# Altium project lagd_pcb.PrjPcb (part 3 of 4)

## Sheet analog_refs.SchDoc
size 699 x 359 mm; SheetNumber: 9; SheetTotal: 13
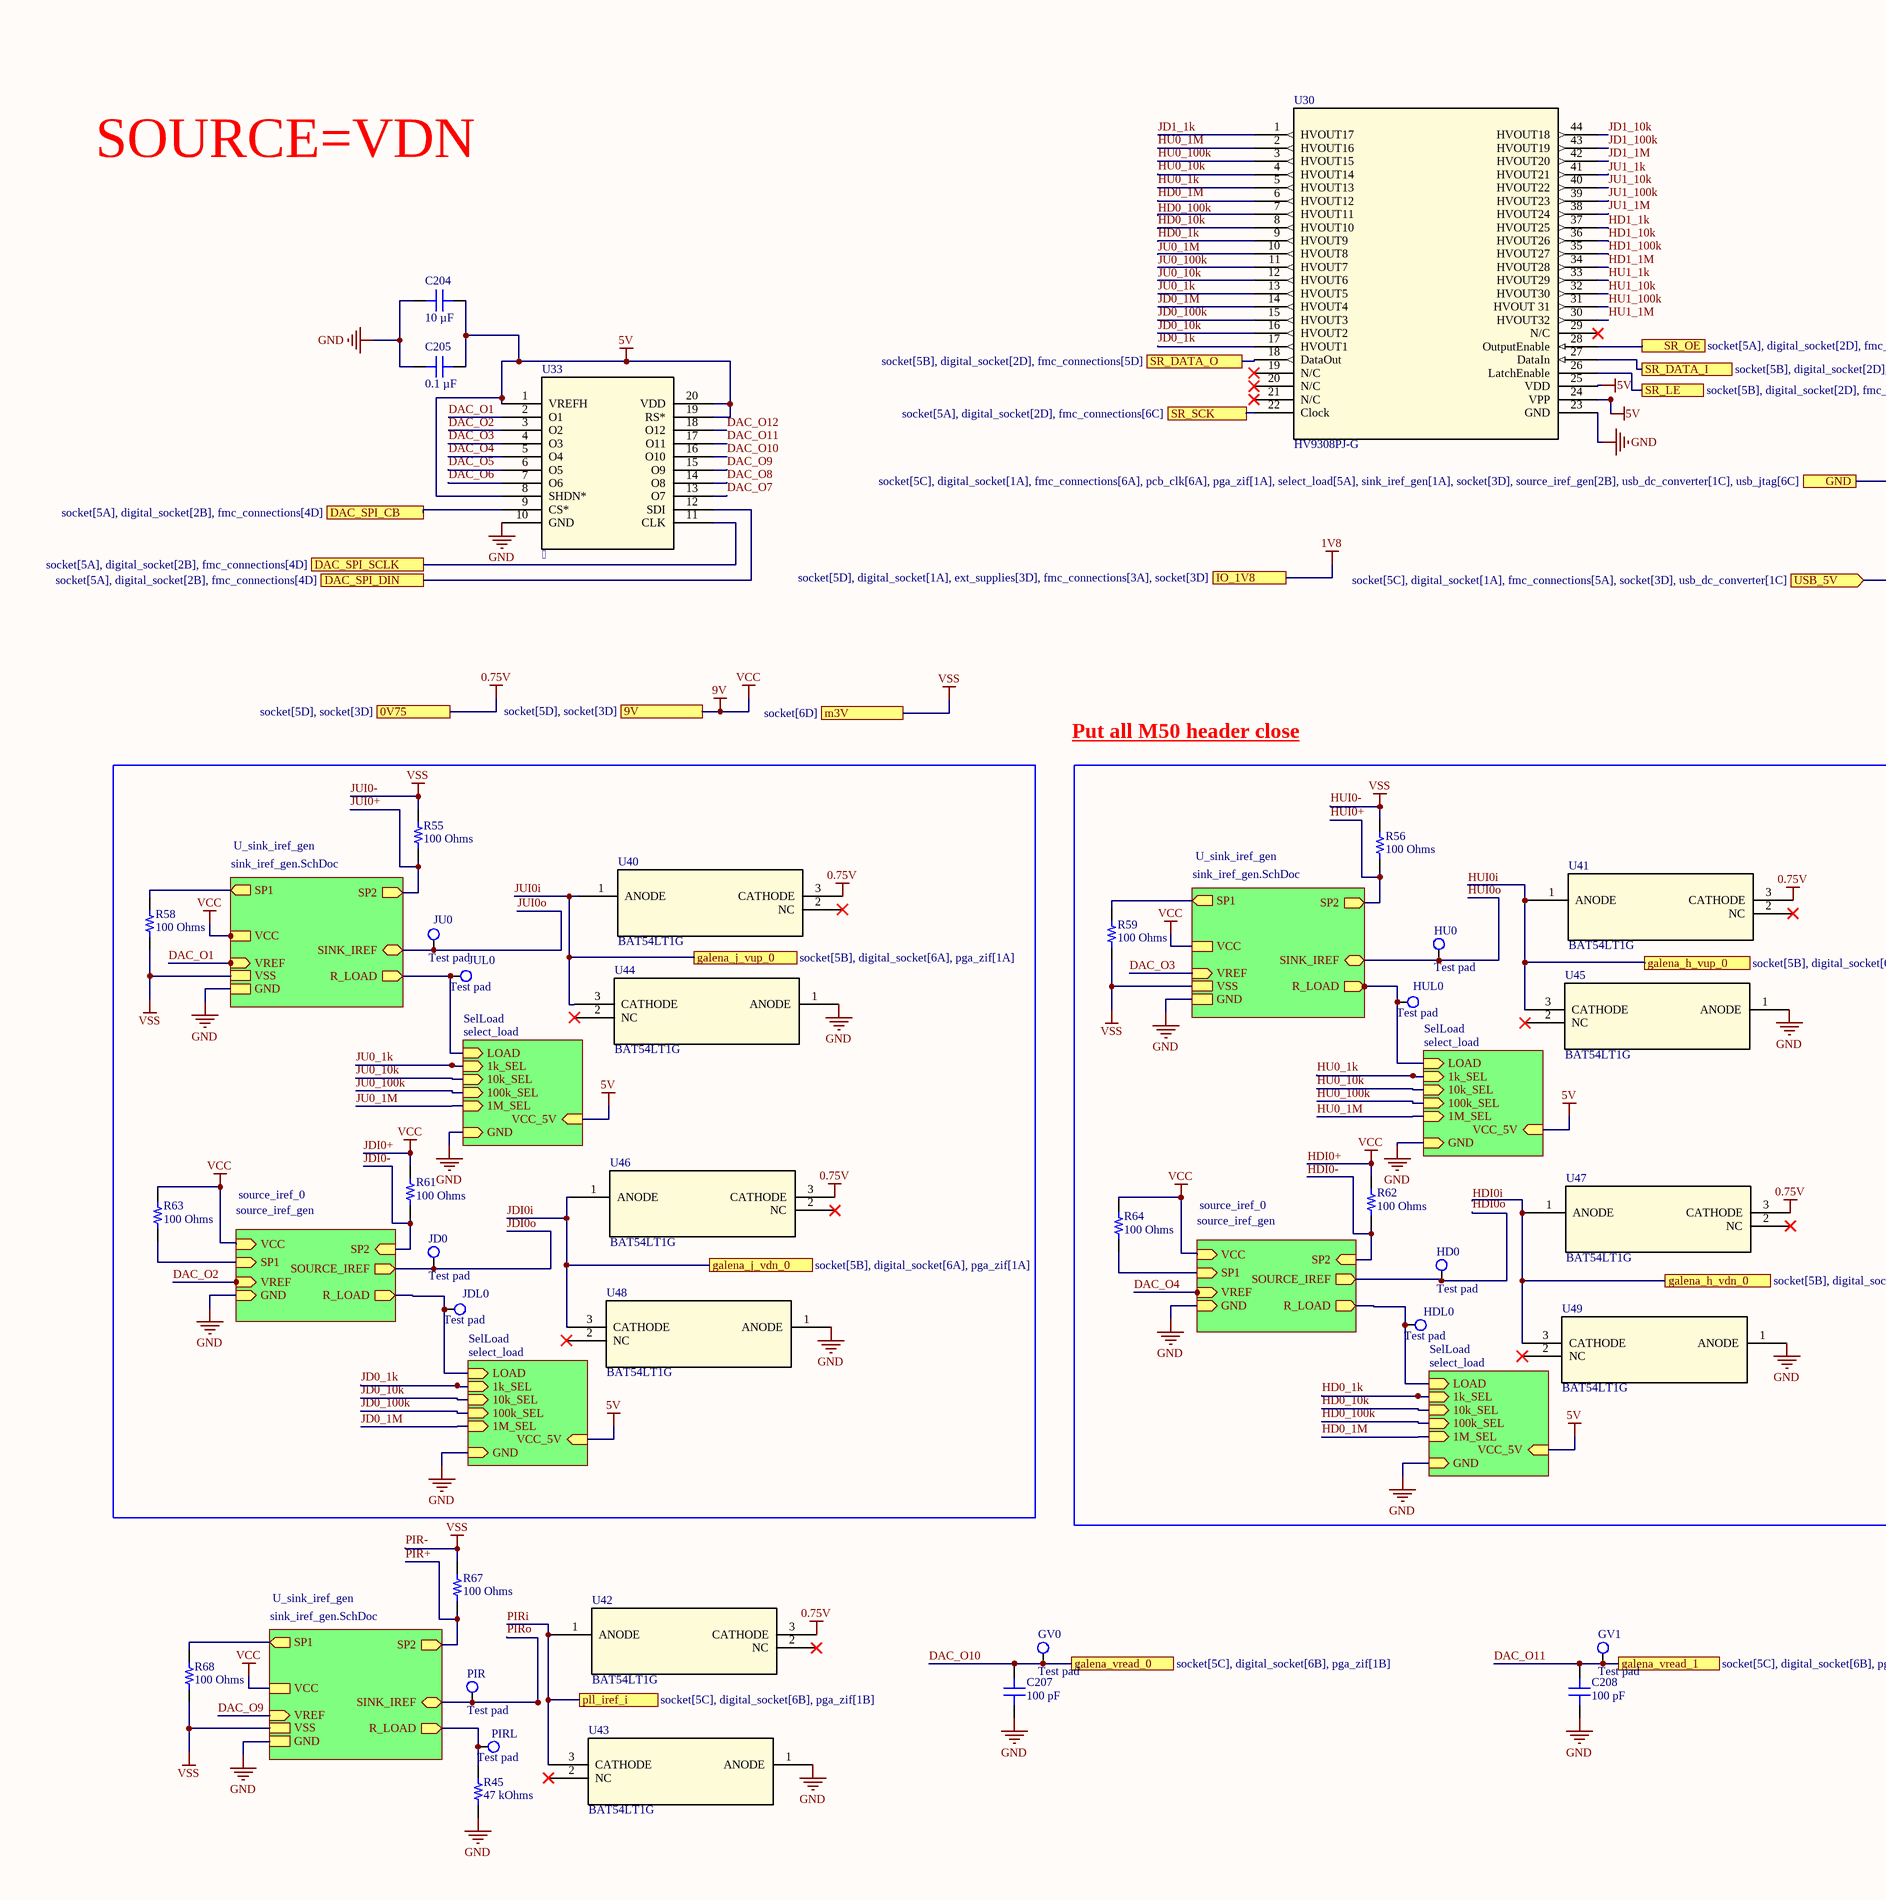
[diagram p5: analog_refs.SchDoc, left]
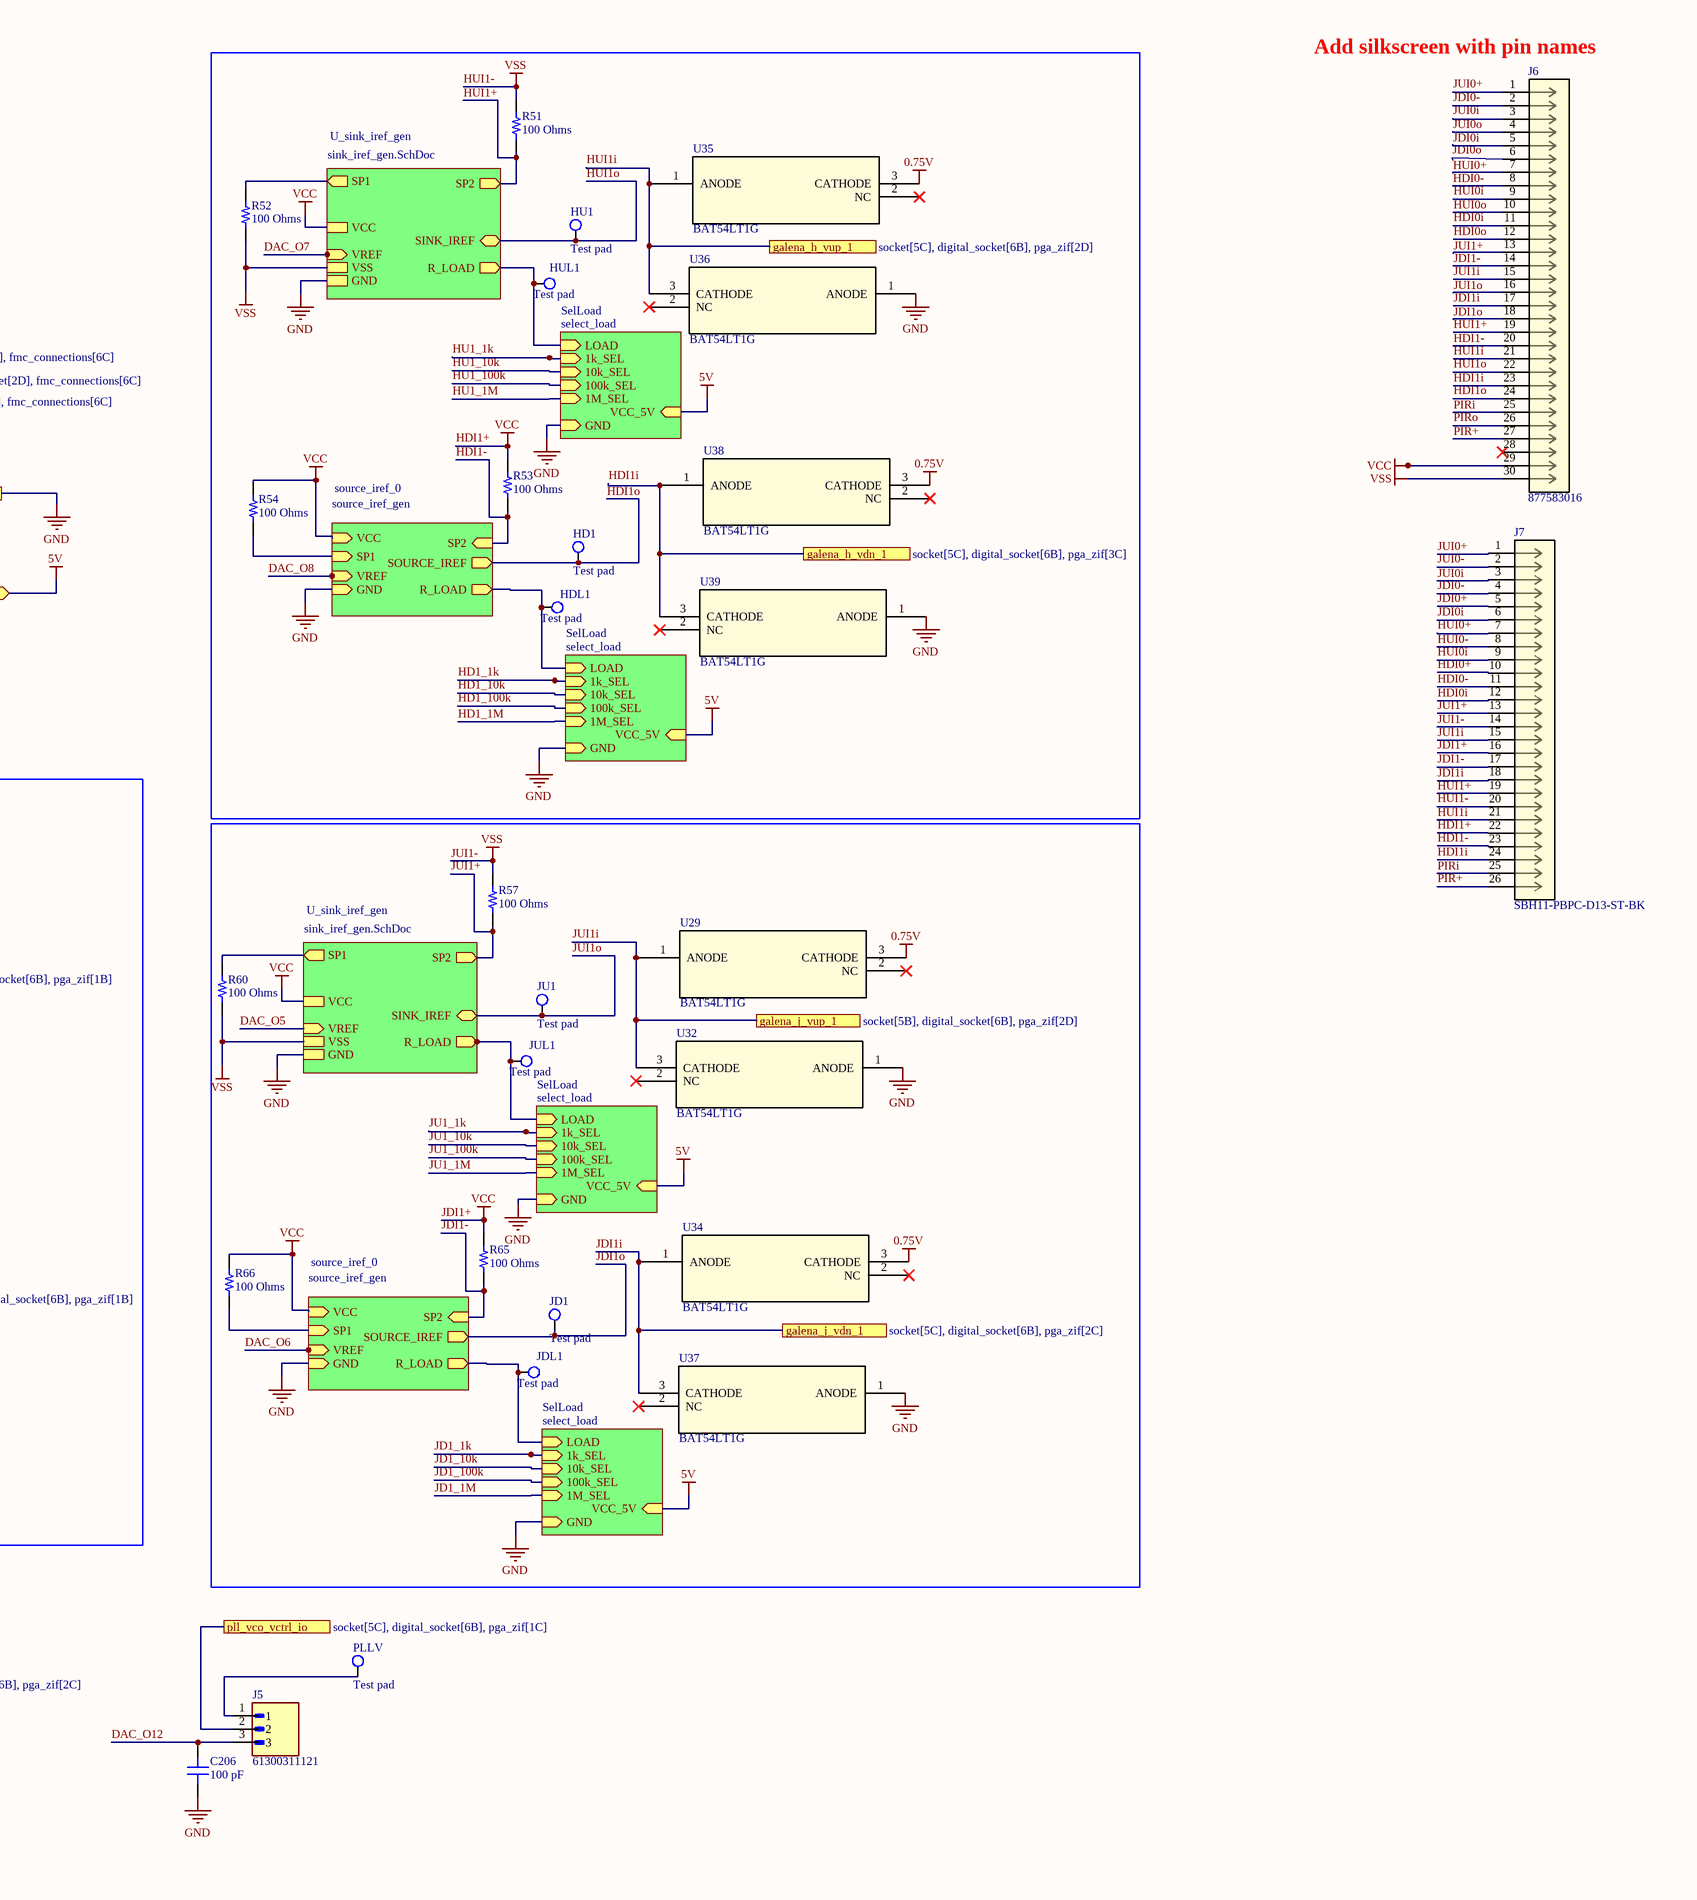
[diagram p6: analog_refs.SchDoc, right]

### Parts
C204  10 µF  [CAP 0805_2012]
C205  0.1 µF  [CAP 0805_2012]
C206  100 pF  [CAP 0805_2012]
C207  100 pF  [CAP 0805_2012]
C208  100 pF  [CAP 0805_2012]
GV0  Test pad  [Test Pad]
GV1  Test pad  [Test Pad]
HD0  Test pad  [Test Pad]
HD1  Test pad  [Test Pad]
HDL0  Test pad  [Test Pad]
HDL1  Test pad  [Test Pad]
HU0  Test pad  [Test Pad]
HU1  Test pad  [Test Pad]
HUL0  Test pad  [Test Pad]
HUL1  Test pad  [Test Pad]
J5  61300311121  [WURTH_61300311121]
J6  877583016  [CONN_SD-87758-107_30_MOL]
J7  SBH11-PBPC-D13-ST-BK  [CONN26_D13-ST-BK_SUL]
JD0  Test pad  [Test Pad]
JD1  Test pad  [Test Pad]
JDL0  Test pad  [Test Pad]
JDL1  Test pad  [Test Pad]
JU0  Test pad  [Test Pad]
JU1  Test pad  [Test Pad]
JUL0  Test pad  [Test Pad]
JUL1  Test pad  [Test Pad]
PIR  Test pad  [Test Pad]
PIRL  Test pad  [Test Pad]
PLLV  Test pad  [Test Pad]
R45  47 kOhms  [RES 0805_2012]
R51  100 Ohms  [RES 0805_2012]
R52  100 Ohms  [RES 0805_2012]
R53  100 Ohms  [RES 0805_2012]
R54  100 Ohms  [RES 0805_2012]
R55  100 Ohms  [RES 0805_2012]
R56  100 Ohms  [RES 0805_2012]
R57  100 Ohms  [RES 0805_2012]
R58  100 Ohms  [RES 0805_2012]
R59  100 Ohms  [RES 0805_2012]
R60  100 Ohms  [RES 0805_2012]
R61  100 Ohms  [RES 0805_2012]
R62  100 Ohms  [RES 0805_2012]
R63  100 Ohms  [RES 0805_2012]
R64  100 Ohms  [RES 0805_2012]
R65  100 Ohms  [RES 0805_2012]
R66  100 Ohms  [RES 0805_2012]
R67  100 Ohms  [RES 0805_2012]
R68  100 Ohms  [RES 0805_2012]
U29  BAT54LT1G  [SOT-23-3_1P4X3P040_ONS]
U30  HV9308PJ-G  [PLCC44_MC_MCH]
U32  BAT54LT1G  [SOT-23-3_1P4X3P040_ONS]
U33    [RU_20_ADI]
U34  BAT54LT1G  [SOT-23-3_1P4X3P040_ONS]
U35  BAT54LT1G  [SOT-23-3_1P4X3P040_ONS]
U36  BAT54LT1G  [SOT-23-3_1P4X3P040_ONS]
U37  BAT54LT1G  [SOT-23-3_1P4X3P040_ONS]
U38  BAT54LT1G  [SOT-23-3_1P4X3P040_ONS]
U39  BAT54LT1G  [SOT-23-3_1P4X3P040_ONS]
U40  BAT54LT1G  [SOT-23-3_1P4X3P040_ONS]
U41  BAT54LT1G  [SOT-23-3_1P4X3P040_ONS]
U42  BAT54LT1G  [SOT-23-3_1P4X3P040_ONS]
U43  BAT54LT1G  [SOT-23-3_1P4X3P040_ONS]
U44  BAT54LT1G  [SOT-23-3_1P4X3P040_ONS]
U45  BAT54LT1G  [SOT-23-3_1P4X3P040_ONS]
U46  BAT54LT1G  [SOT-23-3_1P4X3P040_ONS]
U47  BAT54LT1G  [SOT-23-3_1P4X3P040_ONS]
U48  BAT54LT1G  [SOT-23-3_1P4X3P040_ONS]
U49  BAT54LT1G  [SOT-23-3_1P4X3P040_ONS]

### Sub-sheets
SelLoad = select_load: LOAD (in), 1k_SEL (in), 10k_SEL (in), 100k_SEL (in), 1M_SEL (in), GND (in), VCC_5V (in)
SelLoad = select_load: LOAD (in), 1k_SEL (in), 10k_SEL (in), 100k_SEL (in), 1M_SEL (in), GND (in), VCC_5V (in)
SelLoad = select_load: LOAD (in), 1k_SEL (in), 10k_SEL (in), 100k_SEL (in), 1M_SEL (in), GND (in), VCC_5V (in)
SelLoad = select_load: LOAD (in), 1k_SEL (in), 10k_SEL (in), 100k_SEL (in), 1M_SEL (in), GND (in), VCC_5V (in)
SelLoad = select_load: LOAD (in), 1k_SEL (in), 10k_SEL (in), 100k_SEL (in), 1M_SEL (in), GND (in), VCC_5V (in)
SelLoad = select_load: LOAD (in), 1k_SEL (in), 10k_SEL (in), 100k_SEL (in), 1M_SEL (in), GND (in), VCC_5V (in)
SelLoad = select_load: LOAD (in), 1k_SEL (in), 10k_SEL (in), 100k_SEL (in), 1M_SEL (in), GND (in), VCC_5V (in)
SelLoad = select_load: LOAD (in), 1k_SEL (in), 10k_SEL (in), 100k_SEL (in), 1M_SEL (in), GND (in), VCC_5V (in)
source_iref_0 = source_iref_gen: R_LOAD (out), VREF (in), SOURCE_IREF (out), VCC (in), GND (in), SP1 (in), SP2 (in)
source_iref_0 = source_iref_gen: R_LOAD (out), VREF (in), SOURCE_IREF (out), VCC (in), GND (in), SP1 (in), SP2 (in)
source_iref_0 = source_iref_gen: R_LOAD (out), VREF (in), SOURCE_IREF (out), VCC (in), GND (in), SP1 (in), SP2 (in)
source_iref_0 = source_iref_gen: R_LOAD (out), VREF (in), SOURCE_IREF (out), VCC (in), GND (in), SP1 (in), SP2 (in)
U_sink_iref_gen = sink_iref_gen.SchDoc: SINK_IREF (bidir), R_LOAD (out), VREF (in), GND, VCC, VSS, SP2 (out), SP1 (out)
U_sink_iref_gen = sink_iref_gen.SchDoc: SINK_IREF (bidir), R_LOAD (out), VREF (in), GND, VCC, VSS, SP2 (out), SP1 (out)
U_sink_iref_gen = sink_iref_gen.SchDoc: SINK_IREF (bidir), R_LOAD (out), VREF (in), GND, VCC, VSS, SP2 (out), SP1 (out)
U_sink_iref_gen = sink_iref_gen.SchDoc: SINK_IREF (bidir), R_LOAD (out), VREF (in), GND, VCC, VSS, SP2 (out), SP1 (out)
U_sink_iref_gen = sink_iref_gen.SchDoc: SINK_IREF (bidir), R_LOAD (out), VREF (in), GND, VCC, VSS, SP2 (out), SP1 (out)

### Ports
0V75 (see socket[5D], socket[3D]), 9V (see socket[5D], socket[3D]), DAC_SPI_CB (see socket[5A], digital_socket[2B], fmc_connections[4D]), DAC_SPI_DIN (see socket[5A], digital_socket[2B], fmc_connections[4D]), DAC_SPI_SCLK (see socket[5A], digital_socket[2B], fmc_connections[4D]), galena_h_vdn_0 (see socket[5B], digital_socket[6B], pga_zif[1B]), galena_h_vdn_1 (see socket[5C], digital_socket[6B], pga_zif[3C]), galena_h_vup_0 (see socket[5B], digital_socket[6B], pga_zif[1B]), galena_h_vup_1 (see socket[5C], digital_socket[6B], pga_zif[2D]), galena_j_vdn_0 (see socket[5B], digital_socket[6A], pga_zif[1A]), galena_j_vdn_1 (see socket[5C], digital_socket[6B], pga_zif[2C]), galena_j_vup_0 (see socket[5B], digital_socket[6A], pga_zif[1A]), galena_j_vup_1 (see socket[5B], digital_socket[6B], pga_zif[2D]), galena_vread_0 (see socket[5C], digital_socket[6B], pga_zif[1B]), galena_vread_1 (see socket[5C], digital_socket[6B], pga_zif[2C]), GND (see socket[5C], digital_socket[1A], fmc_connections[6A], pcb_clk[6A], pga_zif[1A], select_load[5A], sink_iref_gen[1A], socket[3D], source_iref_gen[2B], usb_dc_converter[1C], usb_jtag[6C]), IO_1V8 (see socket[5D], digital_socket[1A], ext_supplies[3D], fmc_connections[3A], socket[3D]), m3V (see socket[6D]), pll_iref_i (see socket[5C], digital_socket[6B], pga_zif[1B]), pll_vco_vctrl_io (see socket[5C], digital_socket[6B], pga_zif[1C]), SR_DATA_I (see socket[5B], digital_socket[2D], fmc_connections[6C]), SR_DATA_O (see socket[5B], digital_socket[2D], fmc_connections[5D]), SR_LE (see socket[5B], digital_socket[2D], fmc_connections[6C]), SR_OE (see socket[5A], digital_socket[2D], fmc_connections[6C]), SR_SCK (see socket[5A], digital_socket[2D], fmc_connections[6C]), USB_5V (in, see socket[5C], digital_socket[1A], fmc_connections[5A], socket[3D], usb_dc_converter[1C])

### Nets
0.75V: U29.3(CATHODE) U34.3(CATHODE) U35.3(CATHODE) U38.3(CATHODE) U40.3(CATHODE) U41.3(CATHODE) U42.3(CATHODE) U46.3(CATHODE) U47.3(CATHODE) ; port 0V75  [project net PCB_CORE_0V75]
5V: C204.2 C205.2 U30.24(VPP) U30.25(VDD) U33.1(VREFH) U33.8(SHDN*) U33.19(RS*) U33.20(VDD) ; port USB_5V, sheet SelLoad/VCC_5V, sheet SelLoad/VCC_5V, sheet SelLoad/VCC_5V, sheet SelLoad/VCC_5V, sheet SelLoad/VCC_5V, sheet SelLoad/VCC_5V, sheet SelLoad/VCC_5V, sheet SelLoad/VCC_5V  [project net VBIAS]
GND: C204.1 C205.1 C206.1 C207.1 C208.1 R45.1 U30.23(GND) U32.1(ANODE) U33.10(GND) U36.1(ANODE) U37.1(ANODE) U39.1(ANODE) U43.1(ANODE) U44.1(ANODE) U45.1(ANODE) U48.1(ANODE) U49.1(ANODE) ; port GND, sheet SelLoad/GND, sheet source_iref_0/GND, sheet SelLoad/GND, sheet SelLoad/GND, sheet SelLoad/GND, sheet SelLoad/GND, sheet SelLoad/GND, sheet SelLoad/GND, sheet SelLoad/GND, sheet source_iref_0/GND, sheet source_iref_0/GND, sheet source_iref_0/GND, sheet U_sink_iref_gen/GND, sheet U_sink_iref_gen/GND, sheet U_sink_iref_gen/GND, sheet U_sink_iref_gen/GND, sheet U_sink_iref_gen/GND  [project net A0]
HDI0+: J6.29 J7.5 J7.10 J7.16 J7.22 R53.2 R54.2 R61.2 R62.2 R63.2 R64.2 R65.2 R66.2 ; port 9V, sheet source_iref_0/VCC, sheet source_iref_0/VCC, sheet source_iref_0/VCC, sheet source_iref_0/VCC, sheet U_sink_iref_gen/VCC, sheet U_sink_iref_gen/VCC, sheet U_sink_iref_gen/VCC, sheet U_sink_iref_gen/VCC, sheet U_sink_iref_gen/VCC  [also labelled 9V, HDI1+, JDI0+, JDI1+, VCC]
HUI0-: J6.30 J7.2 J7.8 J7.14 J7.20 R51.2 R52.1 R55.2 R56.2 R57.2 R58.1 R59.1 R60.1 R67.2 R68.1 ; port m3V, sheet U_sink_iref_gen/VSS, sheet U_sink_iref_gen/VSS, sheet U_sink_iref_gen/VSS, sheet U_sink_iref_gen/VSS, sheet U_sink_iref_gen/VSS  [also labelled HUI1-, JUI0-, JUI1-, PIR-, VSS]
DAC_O1: U33.2(O1) ; sheet U_sink_iref_gen/VREF
DAC_O2: U33.3(O2) ; sheet source_iref_0/VREF
DAC_O3: U33.4(O3) ; sheet U_sink_iref_gen/VREF
DAC_O4: U33.5(O4) ; sheet source_iref_0/VREF
DAC_O5: U33.6(O5) ; sheet U_sink_iref_gen/VREF
DAC_O6: U33.7(O6) ; sheet source_iref_0/VREF
DAC_O7: U33.13(O7) ; sheet U_sink_iref_gen/VREF
DAC_O8: U33.14(O8) ; sheet source_iref_0/VREF
DAC_O9: U33.15(O9) ; sheet U_sink_iref_gen/VREF
DAC_O10: C207.2 GV0.1 U33.16(O10) ; port galena_vread_0
DAC_O11: C208.2 GV1.1 U33.17(O11) ; port galena_vread_1
DAC_O12: C206.2 J5.3 U33.18(O12)
HD0_1k: U30.9(HVOUT9) ; sheet SelLoad/1k_SEL
HD0_1M: U30.6(HVOUT12) ; sheet SelLoad/1M_SEL
HD0_10k: U30.8(HVOUT10) ; sheet SelLoad/10k_SEL
HD0_100k: U30.7(HVOUT11) ; sheet SelLoad/100k_SEL
HD1_1k: U30.37(HVOUT25) ; sheet SelLoad/1k_SEL
HD1_1M: U30.34(HVOUT28) ; sheet SelLoad/1M_SEL
HD1_10k: U30.36(HVOUT26) ; sheet SelLoad/10k_SEL
HD1_100k: U30.35(HVOUT27) ; sheet SelLoad/100k_SEL
HDI0-: J6.8 J7.11 R62.1 ; sheet source_iref_0/SP2
HDI0i: J6.11 J7.12 U47.1(ANODE) U49.3(CATHODE) ; port galena_h_vdn_0
HDI0o: HD0.1 J6.12 ; sheet source_iref_0/SOURCE_IREF
HDI1-: J6.20 J7.23 R53.1 ; sheet source_iref_0/SP2
HDI1i: J6.23 J7.24 U38.1(ANODE) U39.3(CATHODE) ; port galena_h_vdn_1
HDI1o: HD1.1 J6.24 ; sheet source_iref_0/SOURCE_IREF
HU0_1k: U30.5(HVOUT13) ; sheet SelLoad/1k_SEL
HU0_1M: U30.2(HVOUT16) ; sheet SelLoad/1M_SEL
HU0_10k: U30.4(HVOUT14) ; sheet SelLoad/10k_SEL
HU0_100k: U30.3(HVOUT15) ; sheet SelLoad/100k_SEL
HU1_1k: U30.33(HVOUT29) ; sheet SelLoad/1k_SEL
HU1_1M: U30.30(HVOUT32) ; sheet SelLoad/1M_SEL
HU1_10k: U30.32(HVOUT30) ; sheet SelLoad/10k_SEL
HU1_100k: U30.31(HVOUT_31) ; sheet SelLoad/100k_SEL
HUI0+: J6.7 J7.7 R56.1 ; sheet U_sink_iref_gen/SP2
HUI0i: J6.9 J7.9 U41.1(ANODE) U45.3(CATHODE) ; port galena_h_vup_0
HUI0o: HU0.1 J6.10 ; sheet U_sink_iref_gen/SINK_IREF
HUI1+: J6.19 J7.19 R51.1 ; sheet U_sink_iref_gen/SP2
HUI1i: J6.21 J7.21 U35.1(ANODE) U36.3(CATHODE) ; port galena_h_vup_1
HUI1o: HU1.1 J6.22 ; sheet U_sink_iref_gen/SINK_IREF
JD0_1k: U30.17(HVOUT1) ; sheet SelLoad/1k_SEL
JD0_1M: U30.14(HVOUT4) ; sheet SelLoad/1M_SEL
JD0_10k: U30.16(HVOUT2) ; sheet SelLoad/10k_SEL
JD0_100k: U30.15(HVOUT3) ; sheet SelLoad/100k_SEL
JD1_1k: U30.1(HVOUT17) ; sheet SelLoad/1k_SEL
JD1_1M: U30.42(HVOUT20) ; sheet SelLoad/1M_SEL
JD1_10k: U30.44(HVOUT18) ; sheet SelLoad/10k_SEL
JD1_100k: U30.43(HVOUT19) ; sheet SelLoad/100k_SEL
JDI0-: J6.2 J7.4 R61.1 ; sheet source_iref_0/SP2
JDI0i: J6.5 J7.6 U46.1(ANODE) U48.3(CATHODE) ; port galena_j_vdn_0
JDI0o: J6.6 JD0.1 ; sheet source_iref_0/SOURCE_IREF
JDI1-: J6.14 J7.17 R65.1 ; sheet source_iref_0/SP2
JDI1i: J6.17 J7.18 U34.1(ANODE) U37.3(CATHODE) ; port galena_j_vdn_1
JDI1o: J6.18 JD1.1 ; sheet source_iref_0/SOURCE_IREF
JU0_1k: U30.13(HVOUT5) ; sheet SelLoad/1k_SEL
JU0_1M: U30.10(HVOUT8) ; sheet SelLoad/1M_SEL
JU0_10k: U30.12(HVOUT6) ; sheet SelLoad/10k_SEL
JU0_100k: U30.11(HVOUT7) ; sheet SelLoad/100k_SEL
JU1_1k: U30.41(HVOUT21) ; sheet SelLoad/1k_SEL
JU1_1M: U30.38(HVOUT24) ; sheet SelLoad/1M_SEL
JU1_10k: U30.40(HVOUT22) ; sheet SelLoad/10k_SEL
JU1_100k: U30.39(HVOUT23) ; sheet SelLoad/100k_SEL
JUI0+: J6.1 J7.1 R55.1 ; sheet U_sink_iref_gen/SP2
JUI0i: J6.3 J7.3 U40.1(ANODE) U44.3(CATHODE) ; port galena_j_vup_0
JUI0o: J6.4 JU0.1 ; sheet U_sink_iref_gen/SINK_IREF
JUI1+: J6.13 J7.13 R57.1 ; sheet U_sink_iref_gen/SP2
JUI1i: J6.15 J7.15 U29.1(ANODE) U32.3(CATHODE) ; port galena_j_vup_1
JUI1o: J6.16 JU1.1 ; sheet U_sink_iref_gen/SINK_IREF
PIR+: J6.27 J7.26 R67.1 ; sheet U_sink_iref_gen/SP2
PIRi: J6.25 J7.25 U42.1(ANODE) U43.3(CATHODE) ; port pll_iref_i
PIRo: J6.26 PIR.1 ; sheet U_sink_iref_gen/SINK_IREF
NetHDL0_1: HDL0.1 ; sheet SelLoad/LOAD, sheet source_iref_0/R_LOAD
NetHDL1_1: HDL1.1 ; sheet SelLoad/LOAD, sheet source_iref_0/R_LOAD
NetHUL0_1: HUL0.1 ; sheet SelLoad/LOAD, sheet U_sink_iref_gen/R_LOAD
NetHUL1_1: HUL1.1 ; sheet SelLoad/LOAD, sheet U_sink_iref_gen/R_LOAD
NetJ2_H3: J5.2 ; port pll_vco_vctrl_io
NetJ5_1: J5.1 PLLV.1
NetJDL0_1: JDL0.1 ; sheet source_iref_0/R_LOAD, sheet SelLoad/LOAD
NetJDL1_1: JDL1.1 ; sheet SelLoad/LOAD, sheet source_iref_0/R_LOAD
NetJUL0_1: JUL0.1 ; sheet SelLoad/LOAD
NetJUL1_1: JUL1.1 ; sheet SelLoad/LOAD, sheet U_sink_iref_gen/R_LOAD
NetPIRL_1: PIRL.1 R45.2 ; sheet U_sink_iref_gen/R_LOAD
NetR52_2: R52.2 ; sheet U_sink_iref_gen/SP1
NetR54_1: R54.1 ; sheet source_iref_0/SP1
NetR58_2: R58.2 ; sheet U_sink_iref_gen/SP1
NetR59_2: R59.2 ; sheet U_sink_iref_gen/SP1
NetR60_2: R60.2 ; sheet U_sink_iref_gen/SP1
NetR63_1: R63.1 ; sheet source_iref_0/SP1
NetR64_1: R64.1 ; sheet source_iref_0/SP1
NetR66_1: R66.1 ; sheet source_iref_0/SP1
NetR68_2: R68.2 ; sheet U_sink_iref_gen/SP1
NetU24_2: U30.18(DataOut) ; port SR_DATA_O
NetU25_10: U30.27(DataIn) ; port SR_DATA_I
NetU25_11: U30.26(LatchEnable) ; port SR_LE
NetU25_12: U30.28(OutputEnable) ; port SR_OE
NetU25_13: U30.22(Clock) ; port SR_SCK
NetU28_11: U33.9(CS*) ; port DAC_SPI_CB
NetU28_12: U33.12(SDI) ; port DAC_SPI_DIN
NetU28_13: U33.11(CLK) ; port DAC_SPI_SCLK

Not connected (* = marked no-connect by the designer): J6 28*; U29 2(NC)*; U30 19(N/C)* 20(N/C)* 21(N/C)* 29(N/C)*; U32 2(NC)*; U34 2(NC)*; U35 2(NC)*; U36 2(NC)*; U37 2(NC)*; U38 2(NC)*; U39 2(NC)*; U40 2(NC)*; U41 2(NC)*; U42 2(NC)*; U43 2(NC)*; U44 2(NC)*; U45 2(NC)*; U46 2(NC)*; U47 2(NC)*; U48 2(NC)*; U49 2(NC)*

### Notes on the sheet
- (near J6) Add silkscreen with pin names
- SOURCE=VDN
- Put all M50 header close

### Library data of the parts
C204 = 0805BW106K160NGT: CAP CER 10UF 16V X5R 0805; manufacturer: Knowles Novacap; Tolerance: ±10%; Part Number: 0805BW106K160NGT; Capacitance: 10 µF; Applications: SMPS Filtering; componentlink1description: Datasheet; componentlink1url: https://www.knowlescapacitors.com/getattachment/6c8d48ef-fc2b-4752-ae2c-ce6c208de0c4/High-Capacitance-Chip.aspx; componentlink2description: DigiKey Link; componentlink2url: https://www.digikey.com/en/products/detail/knowles-novacap/0805BW106K160NGT/7303991; Device Package: 0805 (2012 Metric); Features: Bonding Mountable, Gold Flash Termination; lastupdated: 4/6/2026 7:32:52 PM; Lifecycle Status: Active; Minimum Order: 1; Mounting Type: Surface Mount, MLCC, Epoxy; Operating Temperature: -55°C ~ 85°C; Package / Case: 0805 (2012 Metric); packaging: TapeAndReel; partid: 10571; Part Status: Active; price: 1.74; series: -; Size / Dimension: 0.080" L x 0.050" W (2.03mm x 1.27mm); Supplier 1: DigiKey; Supplier Part Number 1: 1763-1170-1-ND; Temperature Coefficient: X5R; Thickness (Max): 0.054" (1.37mm); value: 10 µF; Voltage - Rated: 16V
C205 = CC0805MRX7R9BB104: CAP CER 0.1UF 50V X7R 0805; manufacturer: Yageo; Tolerance: ±20%; Part Number: CC0805MRX7R9BB104; Capacitance: 0.1 µF; Applications: General Purpose; componentlink1description: Datasheet; componentlink1url: https://www.yageo.com/upload/media/product/productsearch/datasheet/mlcc/UPY-GPHC_X7R_6.3V-to-50V_18.pdf; componentlink2description: DigiKey Link; componentlink2url: https://www.digikey.com/en/products/detail/yageo/CC0805MRX7R9BB104/5884281; Device Package: 0805 (2012 Metric); lastupdated: 4/6/2026 7:33:19 PM; Lifecycle Status: Active; Minimum Order: 1; Mounting Type: Surface Mount, MLCC; Operating Temperature: -55°C ~ 125°C; Package / Case: 0805 (2012 Metric); packaging: TapeAndReel; partid: 2475; Part Status: Active; price: 0.01; series: CC; Size / Dimension: 0.079" L x 0.049" W (2.00mm x 1.25mm); Supplier 1: DigiKey; Supplier Part Number 1: 311-4351-1-ND; Temperature Coefficient: X7R; Thickness (Max): 0.037" (0.95mm); value: 0.1 µF; Voltage - Rated: 50V
C206-C208 = 500R15N101JV4T: CAP CER 100PF 50V C0G/NP0 0805; manufacturer: Johanson Dielectrics Inc.; Temperature Coefficient: C0G, NP0; Tolerance: ±5%; Part Number: 500R15N101JV4T; Capacitance: 100 pF; Applications: General Purpose; componentlink1description: Datasheet; componentlink1url: https://www.johansondielectrics.com/downloads/catalog/johanson-dielectrics-product-catalog.pdf; componentlink2description: DigiKey Link; componentlink2url: https://www.digikey.com/en/products/detail/johanson-dielectrics-inc/500R15N101JV4T/1859421; Device Package: 0805 (2012 Metric); lastupdated: 4/6/2026 7:32:47 PM; Lifecycle Status: Active; Minimum Order: 1; Mounting Type: Surface Mount, MLCC; Operating Temperature: -55°C ~ 125°C; Package / Case: 0805 (2012 Metric); packaging: TapeAndReel; partid: 11835; Part Status: Active; price: 0.02; series: -; Size / Dimension: 0.080" L x 0.050" W (2.03mm x 1.27mm); Supplier 1: DigiKey; Supplier Part Number 1: 709-1176-1-ND; Thickness (Max): 0.050" (1.27mm); value: 100 pF; Voltage - Rated: 50V
J6 = 877583016: 2.00mm Pitch Milli-Grid Header, Through Hole, Vertical, 30 Circuits, 0.38Âµm Gold (Au) Selective Plating, Pocket Tray Packaging, Lead-Free; Manufacturer_Name: Molex Connector Corporation; Copyright: Copyright (C) 2025 Ultra Librarian. All rights reserved.; Manufacturer_Part_Number: 877583016; RefDes: RefDes; Type: Type
J7 = SBH11-PBPC-D13-ST-BK: Description; Manufacturer_Name: Sullins; Copyright: Copyright (C) 2025 Ultra Librarian. All rights reserved.; Manufacturer_Part_Number: SBH11-PBPC-D13-ST-BK; RefDes: RefDes; Type: Type
R45 = CRGP0805F47K: RES 47K OHM 1% 1/3W 0805; Manufacturer: TE Connectivity Passive Product; Power (Watts): 0.333W, 1/3W; Temperature Coefficient: ±100ppm/°C; Part Number: CRGP0805F47K; Value: 47 kOhms; ComponentLink1Description: Datasheet; ComponentLink1URL: https://www.te.com/commerce/DocumentDelivery/DDEController?Action=srchrtrv&DocNm=9-1773463-9&DocType=DS&DocLang=English; ComponentLink2Description: DigiKey Link; ComponentLink2URL: https://www.digikey.com/en/products/detail/te-connectivity-passive-product/CRGP0805F47K/8577099; Composition: Thick Film; Device Package: 0805 (2012 Metric); Features: Automotive AEC-Q200, Pulse Withstanding; Height - Seated (Max): 0.026" (0.65mm); LastUpdated: 4/5/2026 8:11:22 PM; Lifecycle Status: Active; Minimum Order: 1; Number of Terminations: 2; Operating Temperature: -55°C ~ 155°C; Package / Case: 0805 (2012 Metric); Packaging: TapeAndReel; PartId: 28741; Part Status: Active; Price: 0.03; Resistance: 47 kOhms; Series: CRGP; Size / Dimension: 0.079" L x 0.049" W (2.00mm x 1.25mm); Supplier 1: DigiKey; Supplier Part Number 1: A130497CT-ND; Supplier Device Package: 0805; Tolerance: ±1%
R51-R68 = 2-2176091-4: RES SMD 100 OHM 0.1% 1/4W 0805; Manufacturer: TE Connectivity Passive Product; Power (Watts): 0.25W, 1/4W; Temperature Coefficient: ±25ppm/°C; Part Number: 2-2176091-4; Value: 100 Ohms; ComponentLink1Description: Datasheet; ComponentLink1URL: https://www.te.com/commerce/DocumentDelivery/DDEController?Action=srchrtrv&DocNm=1773272&DocType=DS&DocLang=English; ComponentLink2Description: DigiKey Link; ComponentLink2URL: https://www.digikey.com/en/products/detail/te-connectivity-passive-product/2-2176091-4/4033915; Composition: Thin Film; Device Package: 0805 (2012 Metric); Height - Seated (Max): 0.026" (0.65mm); LastUpdated: 4/5/2026 8:11:23 PM; Lifecycle Status: Active; Minimum Order: 1; Number of Terminations: 2; Operating Temperature: -55°C ~ 155°C; Package / Case: 0805 (2012 Metric); Packaging: TapeAndReel; PartId: 28489; Part Status: Active; Price: 0.13; Resistance: 100 Ohms; Series: RP73P, Holsworthy; Size / Dimension: 0.079" L x 0.049" W (2.00mm x 1.25mm); Supplier 1: DigiKey; Supplier Part Number 1: A110447CT-ND; Supplier Device Package: 0805; Tolerance: ±0.1%
U29 U32 U34-U49 = BAT54LT1G: Description; Manufacturer_Name: onsemi; Copyright: Copyright (C) 2025 Ultra Librarian. All rights reserved.; Manufacturer_Part_Number: BAT54LT1G; RefDes: RefDes; Type: Type
U30 = HV9308PJ-G: No Description Available; Manufacturer_Name: Microchip; Copyright: Copyright (C) 2026 Ultra Librarian. All rights reserved.; Manufacturer_Part_Number: HV9308PJ-G; RefDes: RefDes; Type: Type
U33 = AD8802ARUZ-REEL: 12 Channel, 8-Bit TrimDACs with Power Shutdown & Mid-Scale Preset; Manufacturer_Name: Analog Devices Inc; Copyright: Copyright (C) 2026 Ultra Librarian. All rights reserved.; Manufacturer_Part_Number: AD8802ARUZ-REEL; Datasheet: https://www.analog.com/media/en/technical-documentation/data-sheets/AD8802_8804.pdf; RefDes: RefDes; Type: Type
J5 = 61300311121: Package: None; Price: None; Value: *; MP: 61300311121; Availability: Unavailable

## Sheet select_load.SchDoc
size 165 x 63 mm; SheetNumber: 12; SheetTotal: 14
Used 8 times, as channels U_socket/U_analog_refs/SelLoad, U_socket/U_analog_refs/SelLoad, U_socket/U_analog_refs/SelLoad, U_socket/U_analog_refs/SelLoad, U_socket/U_analog_refs/SelLoad, U_socket/U_analog_refs/SelLoad, U_socket/U_analog_refs/SelLoad, U_socket/U_analog_refs/SelLoad. Parts and nets are listed once, with the designators drawn on the sheet.
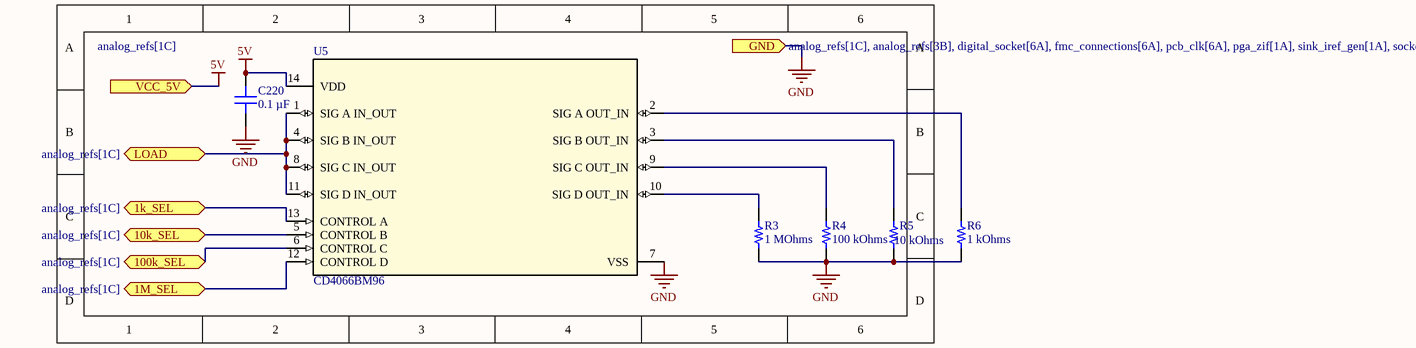
[diagram p7: select_load.SchDoc]

### Parts
C220  0.1 µF  [CAP 0805_2012]
R3  1 MOhms  [YAGEO RES 0805_2012]
R4  100 kOhms  [RES 0805_2012]
R5  10 kOhms  [RES 0805_2012]
R6  1 kOhms  [RES 0805_2012]
U5  CD4066BM96  [D0014A_N]

### Ports
1k_SEL (bidir, see analog_refs[1C]), 1M_SEL (bidir, see analog_refs[1C]), 10k_SEL (bidir, see analog_refs[1C]), 100k_SEL (bidir, see analog_refs[1C]), GND (in, see analog_refs[1C], analog_refs[3B], digital_socket[6A], fmc_connections[6A], pcb_clk[6A], pga_zif[1A], sink_iref_gen[1A], socket[3D], source_iref_gen[2B], usb_dc_converter[1C], usb_jtag[6C]), LOAD (bidir, see analog_refs[1C]), VCC_5V (in, see analog_refs[1C])

### Nets
5V: C220.2 U5.14(VDD) ; port VCC_5V
GND: C220.1 R3.1 R4.1 R5.1 R6.1 U5.7(VSS) ; port GND
1k_SEL: U5.13(CONTROL_A) ; port 1k_SEL
1M_SEL: U5.12(CONTROL_D) ; port 1M_SEL
10k_SEL: U5.5(CONTROL_B) ; port 10k_SEL
100k_SEL: U5.6(CONTROL_C) ; port 100k_SEL
LOAD: U5.1(SIG_A_IN_OUT) U5.4(SIG_B_IN_OUT) U5.8(SIG_C_IN_OUT) U5.11(SIG_D_IN_OUT) ; port LOAD
NetR3_2: R3.2 U5.10(SIG_D_OUT_IN)
NetR4_2: R4.2 U5.9(SIG_C_OUT_IN)
NetR5_2: R5.2 U5.3(SIG_B_OUT_IN)
NetR6_2: R6.2 U5.2(SIG_A_OUT_IN)

### Channels
U_socket/U_analog_refs/SelLoad: designators end in _SelLoad8; ports 1k_SEL=JU0_1k 1M_SEL=JU0_1M 10k_SEL=JU0_10k 100k_SEL=JU0_100k GND=A0 LOAD=NetJUL0_1 VCC_5V=VBIAS
U_socket/U_analog_refs/SelLoad: designators end in _SelLoad7; ports 1k_SEL=JD0_1k 1M_SEL=JD0_1M 10k_SEL=JD0_10k 100k_SEL=JD0_100k GND=A0 LOAD=NetJDL0_1 VCC_5V=VBIAS
U_socket/U_analog_refs/SelLoad: designators end in _SelLoad6; ports 1k_SEL=HU0_1k 1M_SEL=HU0_1M 10k_SEL=HU0_10k 100k_SEL=HU0_100k GND=A0 LOAD=NetHUL0_1 VCC_5V=VBIAS
U_socket/U_analog_refs/SelLoad: designators end in _SelLoad5; ports 1k_SEL=HD0_1k 1M_SEL=HD0_1M 10k_SEL=HD0_10k 100k_SEL=HD0_100k GND=A0 LOAD=NetHDL0_1 VCC_5V=VBIAS
U_socket/U_analog_refs/SelLoad: designators end in _SelLoad4; ports 1k_SEL=JD1_1k 1M_SEL=JD1_1M 10k_SEL=JD1_10k 100k_SEL=JD1_100k GND=A0 LOAD=NetJDL1_1 VCC_5V=VBIAS
U_socket/U_analog_refs/SelLoad: designators end in _SelLoad3; ports 1k_SEL=JU1_1k 1M_SEL=JU1_1M 10k_SEL=JU1_10k 100k_SEL=JU1_100k GND=A0 LOAD=NetJUL1_1 VCC_5V=VBIAS
U_socket/U_analog_refs/SelLoad: designators end in _SelLoad2; ports 1k_SEL=HU1_1k 1M_SEL=HU1_1M 10k_SEL=HU1_10k 100k_SEL=HU1_100k GND=A0 LOAD=NetHUL1_1 VCC_5V=VBIAS
U_socket/U_analog_refs/SelLoad: designators end in _SelLoad1; ports 1k_SEL=HD1_1k 1M_SEL=HD1_1M 10k_SEL=HD1_10k 100k_SEL=HD1_100k GND=A0 LOAD=NetHDL1_1 VCC_5V=VBIAS

### Library data of the parts
C220 = 160R15W104KV4T: CAP CER 0.1UF 16V X7R 0805; manufacturer: Johanson Dielectrics Inc.; Tolerance: ±10%; Part Number: 160R15W104KV4T; Capacitance: 0.1 µF; Applications: General Purpose; componentlink1description: Datasheet; componentlink1url: https://www.johansondielectrics.com/downloads/catalog/johanson-dielectrics-product-catalog.pdf; componentlink2description: DigiKey Link; componentlink2url: https://www.digikey.com/en/products/detail/johanson-dielectrics-inc/160R15W104KV4T/1859428; Device Package: 0805 (2012 Metric); lastupdated: 4/6/2026 7:32:57 PM; Lifecycle Status: Active; Minimum Order: 1; Mounting Type: Surface Mount, MLCC; Operating Temperature: -55°C ~ 125°C; Package / Case: 0805 (2012 Metric); packaging: TapeAndReel; partid: 9125; Part Status: Active; price: 0.03; series: -; Size / Dimension: 0.080" L x 0.050" W (2.03mm x 1.27mm); Supplier 1: DigiKey; Supplier Part Number 1: 709-1183-1-ND; Temperature Coefficient: X7R; Thickness (Max): 0.050" (1.27mm); value: 0.1 µF; Voltage - Rated: 16V
R3 = AC0805FR-7W1ML: RES 1 MOHM 1% 1/4W 0805; Manufacturer: Yageo; Power (Watts): 0.25W, 1/4W; Temperature Coefficient: ±100ppm/°C; Part Number: AC0805FR-7W1ML; Value: 1 MOhms; ComponentLink1Description: Datasheet; ComponentLink1URL: https://www.yageo.com/upload/media/product/productsearch/datasheet/rchip/PYu-AC_51_RoHS_L_9.pdf; ComponentLink2Description: DigiKey Link; ComponentLink2URL: https://www.digikey.com/en/products/detail/yageo/AC0805FR-7W1ML/16982127; Composition: Thick Film; Device Package: 0805 (2012 Metric); Features: Automotive AEC-Q200, Moisture Resistant; Height - Seated (Max): 0.024" (0.60mm); LastUpdated: 4/5/2026 9:17:50 PM; Lifecycle Status: Active; Minimum Order: 1; Number of Terminations: 2; Operating Temperature: -55°C ~ 155°C; Package / Case: 0805 (2012 Metric); Packaging: TapeAndReel; PartId: 76421; Part Status: Active; Price: 0.01; Ratings: AEC-Q200; Resistance: 1 MOhms; Series: AC; Size / Dimension: 0.079" L x 0.049" W (2.00mm x 1.25mm); Supplier 1: DigiKey; Supplier Part Number 1: 13-AC0805FR-7W1MLCT-ND; Supplier Device Package: 0805; Tolerance: ±1%
R4 = 3430A2F100KTDF: 3430 A2 1% 100K 100PPM 1K RL; Manufacturer: TE Connectivity Passive Product; Power (Watts): 1W; Temperature Coefficient: ±100ppm/°C; Part Number: 3430A2F100KTDF; Value: 100 kOhms; ComponentLink1Description: Datasheet; ComponentLink1URL: https://www.te.com/usa-en/product-4-2176559-1.datasheet.pdf; ComponentLink2Description: DigiKey Link; ComponentLink2URL: https://www.digikey.com/en/products/detail/te-connectivity-passive-product/3430A2F100KTDF/17763668; Composition: Thick Film; Device Package: 0805 (2012 Metric); Features: Automotive AEC-Q200; Height - Seated (Max): 0.026" (0.65mm); LastUpdated: 4/5/2026 8:08:27 PM; Lifecycle Status: Active; Minimum Order: 1; Number of Terminations: 2; Operating Temperature: -55°C ~ 155°C; Package / Case: 0805 (2012 Metric); Packaging: TapeAndReel; PartId: 78438; Part Status: Active; Price: 0.02; Ratings: AEC-Q200; Resistance: 100 kOhms; Series: 3430; Size / Dimension: 0.049" L x 0.079" W (1.25mm x 2.00mm); Supplier 1: DigiKey; Supplier Part Number 1: 1712-3430A2F100KTDFCT-ND; Supplier Device Package: 0508; Tolerance: ±1%
R5 = 3430A2F10KTDF: 3430 A2 1% 10K 100PPM 1K RL; Manufacturer: TE Connectivity Passive Product; Power (Watts): 1W; Temperature Coefficient: ±100ppm/°C; Part Number: 3430A2F10KTDF; Value: 10 kOhms; ComponentLink2Description: DigiKey Link; ComponentLink2URL: https://www.digikey.com/en/products/detail/te-connectivity-passive-product/3430A2F10KTDF/17764190; Composition: Thick Film; Device Package: 0805 (2012 Metric); Features: Automotive AEC-Q200; Height - Seated (Max): 0.026" (0.65mm); LastUpdated: 4/5/2026 8:08:30 PM; Lifecycle Status: Active; Minimum Order: 1; Number of Terminations: 2; Operating Temperature: -55°C ~ 155°C; Package / Case: 0805 (2012 Metric); Packaging: TapeAndReel; PartId: 77781; Part Status: Active; Price: 0.02; Ratings: AEC-Q200; Resistance: 10 kOhms; Series: 3430; Size / Dimension: 0.049" L x 0.079" W (1.25mm x 2.00mm); Supplier 1: DigiKey; Supplier Part Number 1: 1712-3430A2F10KTDFCT-ND; Supplier Device Package: 0508; Tolerance: ±1%
R6 = CHP0805AFX-1001ELF: RESHIGHPOWERA 0805 1K 1% 1/2W TC; Manufacturer: Bourns Inc.; Power (Watts): 0.5W, 1/2W; Temperature Coefficient: ±100ppm/°C; Part Number: CHP0805AFX-1001ELF; Value: 1 kOhms; ComponentLink1Description: Datasheet; ComponentLink1URL: https://www.bourns.com/docs/product-datasheets/chp-a.pdf; ComponentLink2Description: DigiKey Link; ComponentLink2URL: https://www.digikey.com/en/products/detail/bourns-inc/CHP0805AFX-1001ELF/12144379; Composition: Thick Film; Device Package: 0805 (2012 Metric); Features: Anti-Sulfur, Automotive AEC-Q200, Moisture Resistant, Pulse Withstanding; Height - Seated (Max): 0.024" (0.60mm); LastUpdated: 4/5/2026 8:09:01 PM; Lifecycle Status: Active; Minimum Order: 1; Number of Terminations: 2; Operating Temperature: -55°C ~ 155°C; Package / Case: 0805 (2012 Metric); Packaging: TapeAndReel; PartId: 66642; Part Status: Active; Price: 0.08; Ratings: AEC-Q200; Resistance: 1 kOhms; Series: CHP-A; Size / Dimension: 0.079" L x 0.049" W (2.00mm x 1.25mm); Supplier 1: DigiKey; Supplier Part Number 1: 118-CHP0805AFX-1001ELFCT-ND; Supplier Device Package: 0805; Tolerance: ±1%
U5 = CD4066BM96: 10-pA on-state leakage current, 20-V, 1:1 (SPST), 4-channel analog switch 14-SOIC -55 to 125; Manufacturer_Name: Texas Instruments; TYPE: TYPE; RefDes: RefDes; Copyright: Copyright (C) 2026 Ultra Librarian. All rights reserved.; Manufacturer_Part_Number: CD4066BM96

## Sheet source_iref_gen.SchDoc
size 254 x 88 mm; SheetNumber: 11; SheetTotal: 13
Used 9 times, as channels U_socket/U_analog_refs/source_iref_0, U_socket/U_analog_refs/source_iref_0, U_socket/U_analog_refs/source_iref_0, U_socket/U_analog_refs/source_iref_0, U_socket/U_analog_refs/U_sink_iref_gen/source_iref, U_socket/U_analog_refs/U_sink_iref_gen/source_iref, U_socket/U_analog_refs/U_sink_iref_gen/source_iref, U_socket/U_analog_refs/U_sink_iref_gen/source_iref, U_socket/U_analog_refs/U_sink_iref_gen/source_iref. Parts and nets are listed once, with the designators drawn on the sheet.
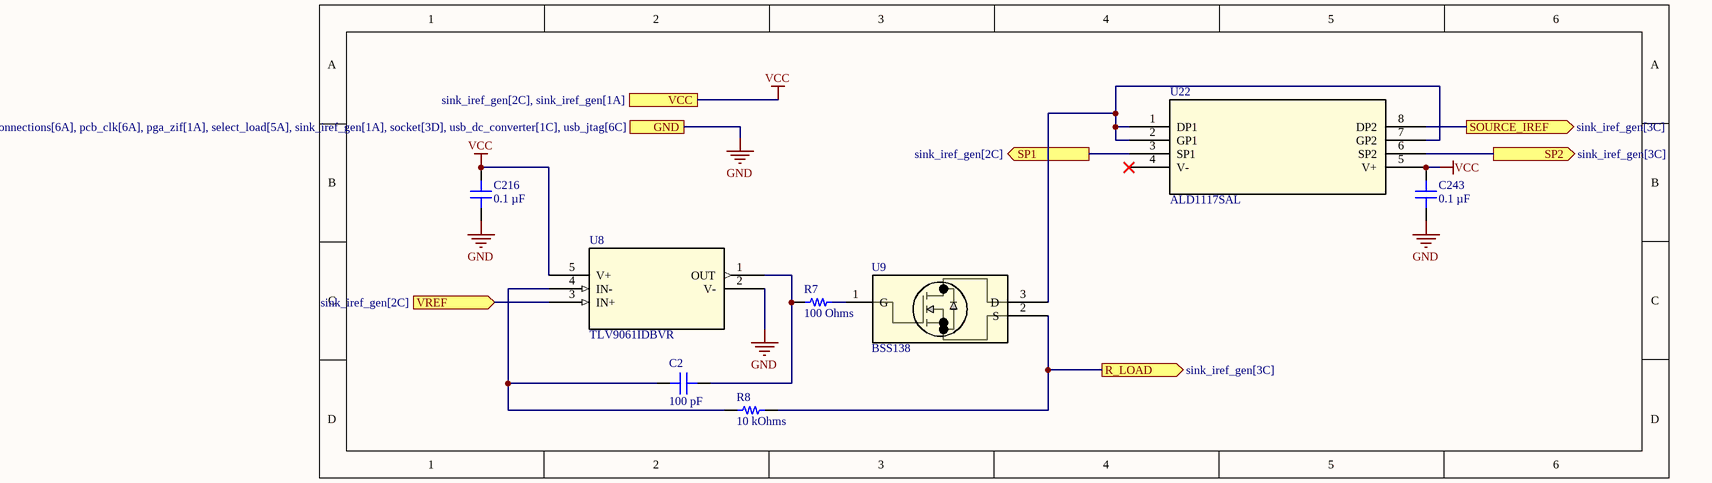
[diagram p8: source_iref_gen.SchDoc]

### Parts
C2  100 pF  [CAP 0805_2012]
C216  0.1 µF  [CAP 0805_2012]
C243  0.1 µF  [CAP 0805_2012]
R7  100 Ohms  [RES 0805_2012]
R8  10 kOhms  [RES 0805_2012]
U8  TLV9061IDBVR  [DBV5_TEX]
U9  BSS138  [SOT-23_3L_ONS]
U22  ALD1117SAL  [8-SOIC_ALD]

### Ports
GND (see sink_iref_gen[2D], analog_refs[3B], digital_socket[6A], fmc_connections[6A], pcb_clk[6A], pga_zif[1A], select_load[5A], sink_iref_gen[1A], socket[3D], usb_dc_converter[1C], usb_jtag[6C]), R_LOAD (out, see sink_iref_gen[3C]), SOURCE_IREF (out, see sink_iref_gen[3C]), SP1 (out, see sink_iref_gen[2C]), SP2 (out, see sink_iref_gen[3C]), VCC (see sink_iref_gen[2C], sink_iref_gen[1A]), VREF (in, see sink_iref_gen[2C])

### Nets
GND: C216.1 C243.1 U8.2(V-) ; port GND
VCC: C216.2 C243.2 U8.5(V+) U22.5(V+) ; port VCC
R_LOAD: R8.2 U9.2(S) ; port R_LOAD
SOURCE_IREF: U22.8(DP2) ; port SOURCE_IREF
SP1: U22.3(SP1) ; port SP1
SP2: U22.6(SP2) ; port SP2
VREF: U8.3(IN+) ; port VREF
NetC2_1: C2.1 R8.1 U8.4(IN-)
NetC2_2: C2.2 R7.2 U8.1(OUT)
NetR7_1: R7.1 U9.1(G)
NetU9_3: U9.3(D) U22.1(DP1) U22.2(GP1) U22.7(GP2)

Not connected (* = marked no-connect by the designer): U22 4(V-)*

### Channels
U_socket/U_analog_refs/source_iref_0: designators end in _source_iref_04; ports GND=A0 R_LOAD=NetJDL0_1 SOURCE_IREF=JDI0o SP1=NetR63_1 SP2=JDI0- VCC=HDI0+ VREF=DAC_O2
U_socket/U_analog_refs/source_iref_0: designators end in _source_iref_03; ports GND=A0 R_LOAD=NetHDL0_1 SOURCE_IREF=HDI0o SP1=NetR64_1 SP2=HDI0- VCC=HDI0+ VREF=DAC_O4
U_socket/U_analog_refs/source_iref_0: designators end in _source_iref_02; ports GND=A0 R_LOAD=NetJDL1_1 SOURCE_IREF=JDI1o SP1=NetR66_1 SP2=JDI1- VCC=HDI0+ VREF=DAC_O6
U_socket/U_analog_refs/source_iref_0: designators end in _source_iref_01; ports GND=A0 R_LOAD=NetHDL1_1 SOURCE_IREF=HDI1o SP1=NetR54_1 SP2=HDI1- VCC=HDI0+ VREF=DAC_O8
U_socket/U_analog_refs/U_sink_iref_gen/source_iref: designators end in _source_iref5; ports GND=A0 R_LOAD=NetR8_source_iref5_2 SOURCE_IREF=NetU6_U_sink_iref_gen5_2 SP1=HDI0+ SP2=HDI0+ VCC=HDI0+ VREF=DAC_O1
U_socket/U_analog_refs/U_sink_iref_gen/source_iref: designators end in _source_iref4; ports GND=A0 R_LOAD=NetHUL0_1 SOURCE_IREF=NetU6_U_sink_iref_gen4_2 SP1=HDI0+ SP2=HDI0+ VCC=HDI0+ VREF=DAC_O3
U_socket/U_analog_refs/U_sink_iref_gen/source_iref: designators end in _source_iref3; ports GND=A0 R_LOAD=NetJUL1_1 SOURCE_IREF=NetU6_U_sink_iref_gen3_2 SP1=HDI0+ SP2=HDI0+ VCC=HDI0+ VREF=DAC_O5
U_socket/U_analog_refs/U_sink_iref_gen/source_iref: designators end in _source_iref2; ports GND=A0 R_LOAD=NetHUL1_1 SOURCE_IREF=NetU6_U_sink_iref_gen2_2 SP1=HDI0+ SP2=HDI0+ VCC=HDI0+ VREF=DAC_O7
U_socket/U_analog_refs/U_sink_iref_gen/source_iref: designators end in _source_iref1; ports GND=A0 R_LOAD=NetPIRL_1 SOURCE_IREF=NetU6_U_sink_iref_gen1_2 SP1=HDI0+ SP2=HDI0+ VCC=HDI0+ VREF=DAC_O9

### Library data of the parts
C2 = 500R15N101JV4T: CAP CER 100PF 50V C0G/NP0 0805; manufacturer: Johanson Dielectrics Inc.; Temperature Coefficient: C0G, NP0; Tolerance: ±5%; Part Number: 500R15N101JV4T; Capacitance: 100 pF; Applications: General Purpose; componentlink1description: Datasheet; componentlink1url: https://www.johansondielectrics.com/downloads/catalog/johanson-dielectrics-product-catalog.pdf; componentlink2description: DigiKey Link; componentlink2url: https://www.digikey.com/en/products/detail/johanson-dielectrics-inc/500R15N101JV4T/1859421; Device Package: 0805 (2012 Metric); lastupdated: 4/6/2026 7:32:47 PM; Lifecycle Status: Active; Minimum Order: 1; Mounting Type: Surface Mount, MLCC; Operating Temperature: -55°C ~ 125°C; Package / Case: 0805 (2012 Metric); packaging: TapeAndReel; partid: 11835; Part Status: Active; price: 0.02; series: -; Size / Dimension: 0.080" L x 0.050" W (2.03mm x 1.27mm); Supplier 1: DigiKey; Supplier Part Number 1: 709-1176-1-ND; Thickness (Max): 0.050" (1.27mm); value: 100 pF; Voltage - Rated: 50V
C216 C243 = 160R15W104KV4T: as C220 on sheet select_load; Part Number: 160R15W104KV4T; Capacitance: 0.1 µF; Applications: General Purpose; componentlink1description: Datasheet; componentlink1url: https://www.johansondielectrics.com/downloads/catalog/johanson-dielectrics-product-catalog.pdf; componentlink2description: DigiKey Link; componentlink2url: https://www.digikey.com/en/products/detail/johanson-dielectrics-inc/160R15W104KV4T/1859428; Device Package: 0805 (2012 Metric); lastupdated: 4/6/2026 7:32:57 PM; Lifecycle Status: Active; Minimum Order: 1; Mounting Type: Surface Mount, MLCC; Operating Temperature: -55°C ~ 125°C; Package / Case: 0805 (2012 Metric); packaging: TapeAndReel; partid: 9125; Part Status: Active; price: 0.03; series: -; Size / Dimension: 0.080" L x 0.050" W (2.03mm x 1.27mm); Supplier 1: DigiKey; Supplier Part Number 1: 709-1183-1-ND; Temperature Coefficient: X7R; Thickness (Max): 0.050" (1.27mm); value: 0.1 µF; Voltage - Rated: 16V
R7 = RCS0805100RFKEA: RES SMD 100 OHM 1% 3/4W 0805; Manufacturer: Vishay Dale; Power (Watts): 0.75W, 3/4W; Temperature Coefficient: ±100ppm/°C; Part Number: RCS0805100RFKEA; Value: 100 Ohms; ComponentLink1Description: Datasheet; ComponentLink1URL: http://www.vishay.com/docs/20065/rcse3.pdf; ComponentLink2Description: DigiKey Link; ComponentLink2URL: https://www.digikey.com/en/products/detail/vishay-dale/RCS0805100RFKEA/5866980; Composition: Thick Film; Device Package: 0805 (2012 Metric); Features: Automotive AEC-Q200, Pulse Withstanding; Height - Seated (Max): 0.020" (0.50mm); LastUpdated: 4/5/2026 8:11:26 PM; Lifecycle Status: Active; Minimum Order: 1; Number of Terminations: 2; Operating Temperature: -55°C ~ 155°C; Package / Case: 0805 (2012 Metric); Packaging: TapeAndReel; PartId: 27784; Part Status: Active; Price: 0.02; Ratings: AEC-Q200; Resistance: 100 Ohms; Series: RCS e3; Size / Dimension: 0.079" L x 0.049" W (2.00mm x 1.25mm); Supplier 1: DigiKey; Supplier Part Number 1: 541-2834-1-ND; Supplier Device Package: 0805; Tolerance: ±1%
R8 = RNCS0805BKE10K0: RES 10K OHM 0.1% 1/10W 0805; Manufacturer: Stackpole Electronics Inc; Power (Watts): 0.1W, 1/10W; Temperature Coefficient: ±25ppm/°C; Part Number: RNCS0805BKE10K0; Value: 10 kOhms; ComponentLink1Description: Datasheet; ComponentLink1URL: https://www.seielect.com/catalog/sei-rncs_rnch.pdf; ComponentLink2Description: DigiKey Link; ComponentLink2URL: https://www.digikey.com/en/products/detail/stackpole-electronics-inc/RNCS0805BKE10K0/1800067; Composition: Thin Film; Device Package: 0805 (2012 Metric); Features: Anti-Corrosive, Automotive AEC-Q200, Moisture Resistant; Height - Seated (Max): 0.026" (0.65mm); LastUpdated: 4/5/2026 8:11:26 PM; Lifecycle Status: Active; Minimum Order: 1; Number of Terminations: 2; Operating Temperature: -55°C ~ 155°C; Package / Case: 0805 (2012 Metric); Packaging: TapeAndReel; PartId: 27713; Part Status: Active; Price: 0.07; Ratings: AEC-Q200; Resistance: 10 kOhms; Series: RNCS; Size / Dimension: 0.079" L x 0.049" W (2.00mm x 1.25mm); Supplier 1: DigiKey; Supplier Part Number 1: RNCS0805BKE10K0CT-ND; Supplier Device Package: 0805; Tolerance: ±0.1%
U8 = TLV9061IDBVR: Single, 5.5-V, 10-MHz, RRIO operational amplifier for cost-optimized applications 5-SOT-23 -40 to 125; Manufacturer_Name: Texas Instruments; Copyright: Copyright (C) 2026 Ultra Librarian. All rights reserved.; Manufacturer_Part_Number: TLV9061IDBVR; RefDes: RefDes; Type: Type
U9 = BSS138: Description; Manufacturer_Name: onsemi; Copyright: Copyright (C) 2025 Ultra Librarian. All rights reserved.; Manufacturer_Part_Number: BSS138; RefDes: RefDes; Type: Type
U22 = ALD1117SAL: No Description Available; Manufacturer_Name: Advanced Linear Devices; Copyright: Copyright (C) 2026 Ultra Librarian. All rights reserved.; Manufacturer_Part_Number: ALD1117SAL; RefDes: RefDes; Type: Type

## Sheet sink_iref_gen.SchDoc
size 177 x 63 mm; SheetNumber: 10; SheetTotal: 13
Used 5 times, as channels U_socket/U_analog_refs/U_sink_iref_gen, U_socket/U_analog_refs/U_sink_iref_gen, U_socket/U_analog_refs/U_sink_iref_gen, U_socket/U_analog_refs/U_sink_iref_gen, U_socket/U_analog_refs/U_sink_iref_gen. Parts and nets are listed once, with the designators drawn on the sheet.
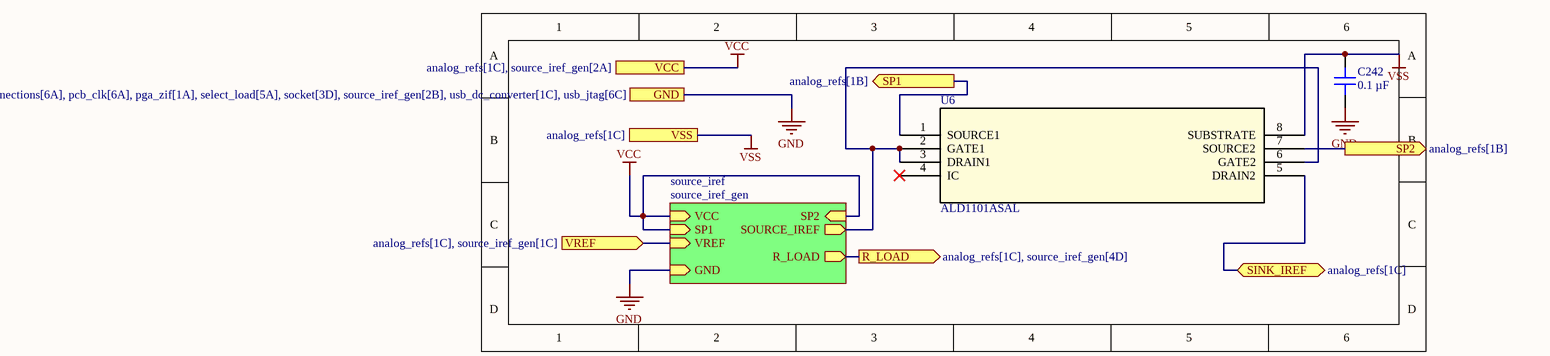
[diagram p9: sink_iref_gen.SchDoc]

### Parts
C242  0.1 µF  [CAP 0805_2012]
U6  ALD1101ASAL  [8-SOIC_ALD]

### Sub-sheets
source_iref = source_iref_gen: R_LOAD (out), VREF (in), SOURCE_IREF (out), VCC (in), GND (in), SP1 (in), SP2 (in)

### Ports
GND (see analog_refs[1C], analog_refs[3B], digital_socket[6A], fmc_connections[6A], pcb_clk[6A], pga_zif[1A], select_load[5A], socket[3D], source_iref_gen[2B], usb_dc_converter[1C], usb_jtag[6C]), R_LOAD (out, see analog_refs[1C], source_iref_gen[4D]), SINK_IREF (bidir, see analog_refs[1C]), SP1 (out, see analog_refs[1B]), SP2 (out, see analog_refs[1B]), VCC (see analog_refs[1C], source_iref_gen[2A]), VREF (in, see analog_refs[1C], source_iref_gen[1C]), VSS (see analog_refs[1C])

### Nets
GND: C242.1 ; port GND, sheet source_iref/GND
VCC: port VCC, sheet source_iref/VCC, sheet source_iref/SP1, sheet source_iref/SP2
VSS: C242.2 U6.8(SUBSTRATE) ; port VSS
R_LOAD: port R_LOAD, sheet source_iref/R_LOAD
SINK_IREF: U6.5(DRAIN2) ; port SINK_IREF
SP1: U6.1(SOURCE1) ; port SP1
SP2: U6.7(SOURCE2) ; port SP2
VREF: port VREF, sheet source_iref/VREF
NetU6_2: U6.2(GATE1) U6.3(DRAIN1) U6.6(GATE2) ; sheet source_iref/SOURCE_IREF

Not connected (* = marked no-connect by the designer): U6 4(IC)*

### Channels
U_socket/U_analog_refs/U_sink_iref_gen: designators C242=C242_u_sink_iref_gen5 U6=U6_U_sink_iref_gen5; ports GND=A0 R_LOAD=NetR8_source_iref5_2 SINK_IREF=JUI0o SP1=NetR58_2 SP2=JUI0+ VCC=HDI0+ VREF=DAC_O1 VSS=HUI0-
U_socket/U_analog_refs/U_sink_iref_gen: designators end in _U_sink_iref_gen4; ports GND=A0 R_LOAD=NetHUL0_1 SINK_IREF=HUI0o SP1=NetR59_2 SP2=HUI0+ VCC=HDI0+ VREF=DAC_O3 VSS=HUI0-
U_socket/U_analog_refs/U_sink_iref_gen: designators C242=C242_u_sink_iref_gen3 U6=U6_U_sink_iref_gen3; ports GND=A0 R_LOAD=NetJUL1_1 SINK_IREF=JUI1o SP1=NetR60_2 SP2=JUI1+ VCC=HDI0+ VREF=DAC_O5 VSS=HUI0-
U_socket/U_analog_refs/U_sink_iref_gen: designators C242=C242_u_sink_iref_gen2 U6=U6_U_sink_iref_gen2; ports GND=A0 R_LOAD=NetHUL1_1 SINK_IREF=HUI1o SP1=NetR52_2 SP2=HUI1+ VCC=HDI0+ VREF=DAC_O7 VSS=HUI0-
U_socket/U_analog_refs/U_sink_iref_gen: designators C242=C242_u_sink_iref_gen1 U6=U6_U_sink_iref_gen1; ports GND=A0 R_LOAD=NetPIRL_1 SINK_IREF=PIRo SP1=NetR68_2 SP2=PIR+ VCC=HDI0+ VREF=DAC_O9 VSS=HUI0-

### Library data of the parts
C242 = 160R15W104KV4T: as C220 on sheet select_load; Part Number: 160R15W104KV4T; Capacitance: 0.1 µF; Applications: General Purpose; componentlink1description: Datasheet; componentlink1url: https://www.johansondielectrics.com/downloads/catalog/johanson-dielectrics-product-catalog.pdf; componentlink2description: DigiKey Link; componentlink2url: https://www.digikey.com/en/products/detail/johanson-dielectrics-inc/160R15W104KV4T/1859428; Device Package: 0805 (2012 Metric); lastupdated: 4/6/2026 7:32:57 PM; Lifecycle Status: Active; Minimum Order: 1; Mounting Type: Surface Mount, MLCC; Operating Temperature: -55°C ~ 125°C; Package / Case: 0805 (2012 Metric); packaging: TapeAndReel; partid: 9125; Part Status: Active; price: 0.03; series: -; Size / Dimension: 0.080" L x 0.050" W (2.03mm x 1.27mm); Supplier 1: DigiKey; Supplier Part Number 1: 709-1183-1-ND; Temperature Coefficient: X7R; Thickness (Max): 0.050" (1.27mm); value: 0.1 µF; Voltage - Rated: 16V
U6 = ALD1101ASAL: No Description Available; Manufacturer_Name: Advanced Linear Devices; Copyright: Copyright (C) 2026 Ultra Librarian. All rights reserved.; Manufacturer_Part_Number: ALD1101ASAL; RefDes: RefDes; Type: Type

## Sheet digital_socket.SchDoc
size 250 x 190 mm; SheetNumber: 6; SheetTotal: 13
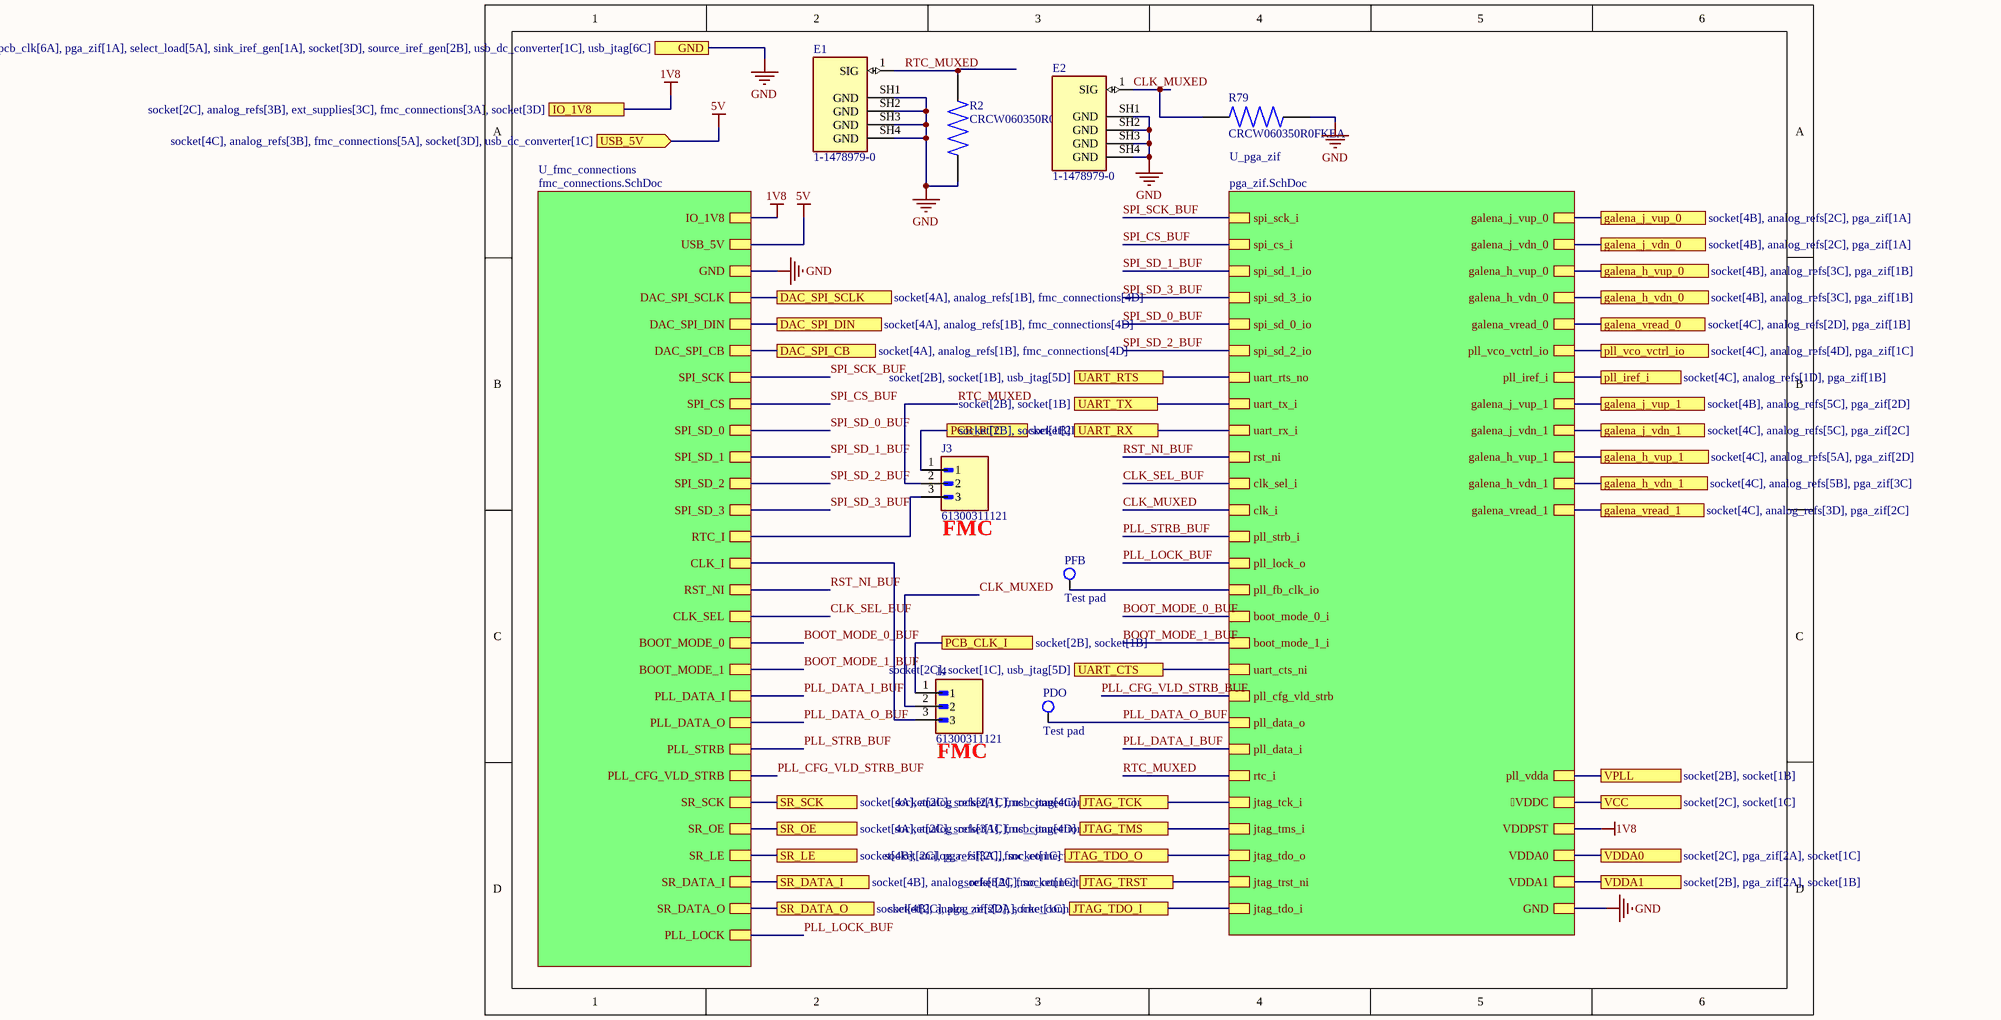
[diagram p10: digital_socket.SchDoc]

### Parts
E1  1-1478979-0  [TE_1-1478979-0]
E2  1-1478979-0  [TE_1-1478979-0]
J3  61300311121  [WURTH_61300311121]
J4  61300311121  [WURTH_61300311121]
PDO  Test pad  [Test Pad]
PFB  Test pad  [Test Pad]
R2  CRCW060350R0FKEA  [RESC1508X50N]
R79  CRCW060350R0FKEA  [RESC1508X50N]

### Sub-sheets
U_fmc_connections = fmc_connections.SchDoc: IO_1V8, USB_5V, GND, DAC_SPI_SCLK, DAC_SPI_DIN, DAC_SPI_CB, SPI_SCK, SPI_CS, SPI_SD_0, SPI_SD_1, SPI_SD_2, SPI_SD_3, RTC_I, CLK_I, RST_NI, CLK_SEL, BOOT_MODE_0, BOOT_MODE_1, PLL_DATA_I, PLL_DATA_O, PLL_STRB, PLL_CFG_VLD_STRB, SR_SCK, SR_OE, SR_LE, SR_DATA_I, SR_DATA_O, PLL_LOCK
U_pga_zif = pga_zif.SchDoc: GND, VDDC, VDDPST, VDDA0, VDDA1, galena_j_vup_0, galena_j_vdn_0, spi_sck_i, spi_cs_i, spi_sd_1_io, spi_sd_3_io, galena_h_vup_0, galena_h_vdn_0, spi_sd_0_io, spi_sd_2_io, uart_rts_no, pll_iref_i, galena_vread_0, uart_tx_i, uart_rx_i, rst_ni, clk_sel_i, clk_i, pll_vco_vctrl_io, pll_strb_i, pll_lock_o, pll_fb_clk_io, boot_mode_0_i, boot_mode_1_i, uart_cts_ni, pll_cfg_vld_strb, pll_data_o, pll_data_i, galena_h_vdn_1, rtc_i, jtag_tck_i, jtag_tms_i, jtag_tdo_o, galena_vread_1, galena_j_vdn_1, jtag_trst_ni, jtag_tdo_i, galena_j_vup_1, galena_h_vup_1, pll_vdda

### Ports
DAC_SPI_CB (see socket[4A], analog_refs[1B], fmc_connections[4D]), DAC_SPI_DIN (see socket[4A], analog_refs[1B], fmc_connections[4D]), DAC_SPI_SCLK (see socket[4A], analog_refs[1B], fmc_connections[4D]), galena_h_vdn_0 (see socket[4B], analog_refs[3C], pga_zif[1B]), galena_h_vdn_1 (see socket[4C], analog_refs[5B], pga_zif[3C]), galena_h_vup_0 (see socket[4B], analog_refs[3C], pga_zif[1B]), galena_h_vup_1 (see socket[4C], analog_refs[5A], pga_zif[2D]), galena_j_vdn_0 (see socket[4B], analog_refs[2C], pga_zif[1A]), galena_j_vdn_1 (see socket[4C], analog_refs[5C], pga_zif[2C]), galena_j_vup_0 (see socket[4B], analog_refs[2C], pga_zif[1A]), galena_j_vup_1 (see socket[4B], analog_refs[5C], pga_zif[2D]), galena_vread_0 (see socket[4C], analog_refs[2D], pga_zif[1B]), galena_vread_1 (see socket[4C], analog_refs[3D], pga_zif[2C]), GND (see socket[4C], analog_refs[3B], fmc_connections[6A], pcb_clk[6A], pga_zif[1A], select_load[5A], sink_iref_gen[1A], socket[3D], source_iref_gen[2B], usb_dc_converter[1C], usb_jtag[6C]), IO_1V8 (see socket[2C], analog_refs[3B], ext_supplies[3C], fmc_connections[3A], socket[3D]), JTAG_TCK (see socket[2C], socket[1C], usb_jtag[4C]), JTAG_TDO_I (see socket[2C], pga_zif[2D], socket[1C]), JTAG_TDO_O (see socket[2C], pga_zif[2C], socket[1C]), JTAG_TMS (see socket[2C], socket[1C], usb_jtag[4D]), JTAG_TRST (see socket[2C], socket[1C]), PCB_CLK_I (see socket[2B], socket[1B]), PCB_RTC (see socket[2B], socket[1B]), pll_iref_i (see socket[4C], analog_refs[1D], pga_zif[1B]), pll_vco_vctrl_io (see socket[4C], analog_refs[4D], pga_zif[1C]), SR_DATA_I (see socket[4B], analog_refs[3A], fmc_connections[6C]), SR_DATA_O (see socket[4B], analog_refs[2A], fmc_connections[5D]), SR_LE (see socket[4B], analog_refs[3A], fmc_connections[6C]), SR_OE (see socket[4A], analog_refs[3A], fmc_connections[6C]), SR_SCK (see socket[4A], analog_refs[2A], fmc_connections[6C]), UART_CTS (see socket[2C], socket[1C], usb_jtag[5D]), UART_RTS (see socket[2B], socket[1B], usb_jtag[5D]), UART_RX (see socket[2B], socket[1B]), UART_TX (see socket[2B], socket[1B]), USB_5V (in, see socket[4C], analog_refs[3B], fmc_connections[5A], socket[3D], usb_dc_converter[1C]), VCC (see socket[2C], socket[1C]), VDDA0 (see socket[2C], pga_zif[2A], socket[1C]), VDDA1 (see socket[2B], pga_zif[2A], socket[1B]), VPLL (see socket[2B], socket[1B])

### Nets
1V8: port IO_1V8, port JTAG_TRST, sheet U_fmc_connections/IO_1V8, sheet U_pga_zif/VDDPST, sheet U_pga_zif/jtag_trst_ni  [project net A2]
5V: port USB_5V, sheet U_fmc_connections/USB_5V  [project net VBIAS]
Galena_1_0V75: port VDDA0, sheet U_pga_zif/VDDA0
Galena_2_0V75: port VDDA1, sheet U_pga_zif/VDDA1
GND: E1.SH1(GND) E1.SH2(GND) E1.SH3(GND) E1.SH4(GND) E2.SH1(GND) E2.SH2(GND) E2.SH3(GND) E2.SH4(GND) R2.1 R79.2 ; port GND, sheet U_fmc_connections/GND, sheet U_pga_zif/GND  [project net A0]
PCB_CORE_0V75: port VCC, sheet U_pga_zif/VDDC
VPLL: port VPLL, sheet U_pga_zif/pll_vdda
1AD0/: port JTAG_TCK, sheet U_pga_zif/jtag_tck_i
1AD1/: port JTAG_TDO_I, sheet U_pga_zif/jtag_tdo_i
1AD2/: port JTAG_TDO_O, sheet U_pga_zif/jtag_tdo_o
1AD3/: port JTAG_TMS, sheet U_pga_zif/jtag_tms_i
1CD0/: port UART_RX, sheet U_pga_zif/uart_rx_i
1CD1/: port UART_TX, sheet U_pga_zif/uart_tx_i
1CD2/: port UART_CTS, sheet U_pga_zif/uart_cts_ni
1CD3/: port UART_RTS, sheet U_pga_zif/uart_rts_no
BOOT_MODE_0_BUF: sheet U_fmc_connections/BOOT_MODE_0, sheet U_pga_zif/boot_mode_0_i
BOOT_MODE_1_BUF: sheet U_fmc_connections/BOOT_MODE_1, sheet U_pga_zif/boot_mode_1_i
CLK_MUXED: E2.1(SIG) J4.2 R79.1 ; sheet U_pga_zif/clk_i
CLK_SEL_BUF: sheet U_fmc_connections/CLK_SEL, sheet U_pga_zif/clk_sel_i
DAC_O10: port galena_vread_0, sheet U_pga_zif/galena_vread_0
DAC_O11: port galena_vread_1, sheet U_pga_zif/galena_vread_1
HDI0i: port galena_h_vdn_0, sheet U_pga_zif/galena_h_vdn_0
HDI1i: port galena_h_vdn_1, sheet U_pga_zif/galena_h_vdn_1
HUI0i: port galena_h_vup_0, sheet U_pga_zif/galena_h_vup_0
HUI1i: port galena_h_vup_1, sheet U_pga_zif/galena_h_vup_1
JDI0i: port galena_j_vdn_0, sheet U_pga_zif/galena_j_vdn_0
JDI1i: port galena_j_vdn_1, sheet U_pga_zif/galena_j_vdn_1
JUI0i: port galena_j_vup_0, sheet U_pga_zif/galena_j_vup_0
JUI1i: port galena_j_vup_1, sheet U_pga_zif/galena_j_vup_1
PIRi: port pll_iref_i, sheet U_pga_zif/pll_iref_i
PLL_CFG_VLD_STRB_BUF: sheet U_fmc_connections/PLL_CFG_VLD_STRB, sheet U_pga_zif/pll_cfg_vld_strb
PLL_DATA_I_BUF: sheet U_fmc_connections/PLL_DATA_I, sheet U_pga_zif/pll_data_i
PLL_DATA_O_BUF: PDO.1 ; sheet U_fmc_connections/PLL_DATA_O, sheet U_pga_zif/pll_data_o
PLL_LOCK_BUF: sheet U_fmc_connections/PLL_LOCK, sheet U_pga_zif/pll_lock_o
PLL_STRB_BUF: sheet U_fmc_connections/PLL_STRB, sheet U_pga_zif/pll_strb_i
RST_NI_BUF: sheet U_fmc_connections/RST_NI, sheet U_pga_zif/rst_ni
RTC_MUXED: E1.1(SIG) J3.2 R2.2 ; sheet U_pga_zif/rtc_i
SPI_CS_BUF: sheet U_fmc_connections/SPI_CS, sheet U_pga_zif/spi_cs_i
SPI_SCK_BUF: sheet U_fmc_connections/SPI_SCK, sheet U_pga_zif/spi_sck_i
SPI_SD_0_BUF: sheet U_fmc_connections/SPI_SD_0, sheet U_pga_zif/spi_sd_0_io
SPI_SD_1_BUF: sheet U_fmc_connections/SPI_SD_1, sheet U_pga_zif/spi_sd_1_io
SPI_SD_2_BUF: sheet U_fmc_connections/SPI_SD_2, sheet U_pga_zif/spi_sd_2_io
SPI_SD_3_BUF: sheet U_fmc_connections/SPI_SD_3, sheet U_pga_zif/spi_sd_3_io
NetJ2_G3: PFB.1 ; sheet U_pga_zif/pll_fb_clk_io
NetJ2_H3: port pll_vco_vctrl_io, sheet U_pga_zif/pll_vco_vctrl_io
NetJ3_1: J3.1 ; port PCB_RTC
NetJ3_3: J3.3 ; sheet U_fmc_connections/RTC_I
NetJ4_1: J4.1 ; port PCB_CLK_I
NetJ4_3: J4.3 ; sheet U_fmc_connections/CLK_I
NetU24_2: port SR_DATA_O, sheet U_fmc_connections/SR_DATA_O
NetU25_10: port SR_DATA_I, sheet U_fmc_connections/SR_DATA_I
NetU25_11: port SR_LE, sheet U_fmc_connections/SR_LE
NetU25_12: port SR_OE, sheet U_fmc_connections/SR_OE
NetU25_13: port SR_SCK, sheet U_fmc_connections/SR_SCK
NetU28_11: port DAC_SPI_CB, sheet U_fmc_connections/DAC_SPI_CB
NetU28_12: port DAC_SPI_DIN, sheet U_fmc_connections/DAC_SPI_DIN
NetU28_13: port DAC_SPI_SCLK, sheet U_fmc_connections/DAC_SPI_SCLK

### Notes on the sheet
- (near J3) FMC
- (near J4) FMC

### Library data of the parts
R2 R79 = CRCW060350R0FKEA: Resistor,Thick Film,50 Ohms,0.1 W,1%,SMT,0603,TCR 37 ppm/DegC,Cut Tape | Vishay Dale CRCW060350R0FKEA; MF: Vishay Intertechnology; SnapEDA_Link: https://www.snapeda.com/parts/CRCW060350R0FKEA/Vishay/view-part/?ref=snap; Package: Package; Value: *; MP: CRCW060350R0FKEA; Check_prices: https://www.snapeda.com/parts/CRCW060350R0FKEA/Vishay/view-part/?ref=eda
E1 E2 = 1-1478979-0: Package: None; Price: None; Value: *; MP: 1-1478979-0; Availability: Unavailable
J3 J4 = 61300311121: Package: None; Price: None; Value: *; MP: 61300311121; Availability: Unavailable